# EAGLE design Prop_Fan (EAGLE 7.4.0)
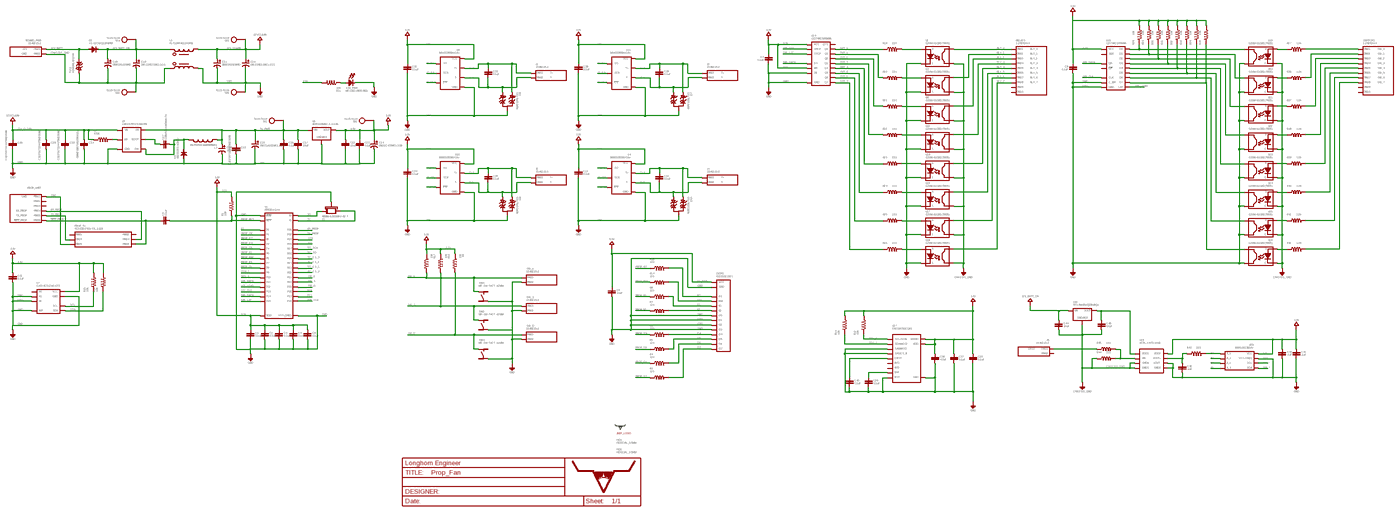
[diagram p0: schematic, sheet 1, overview]
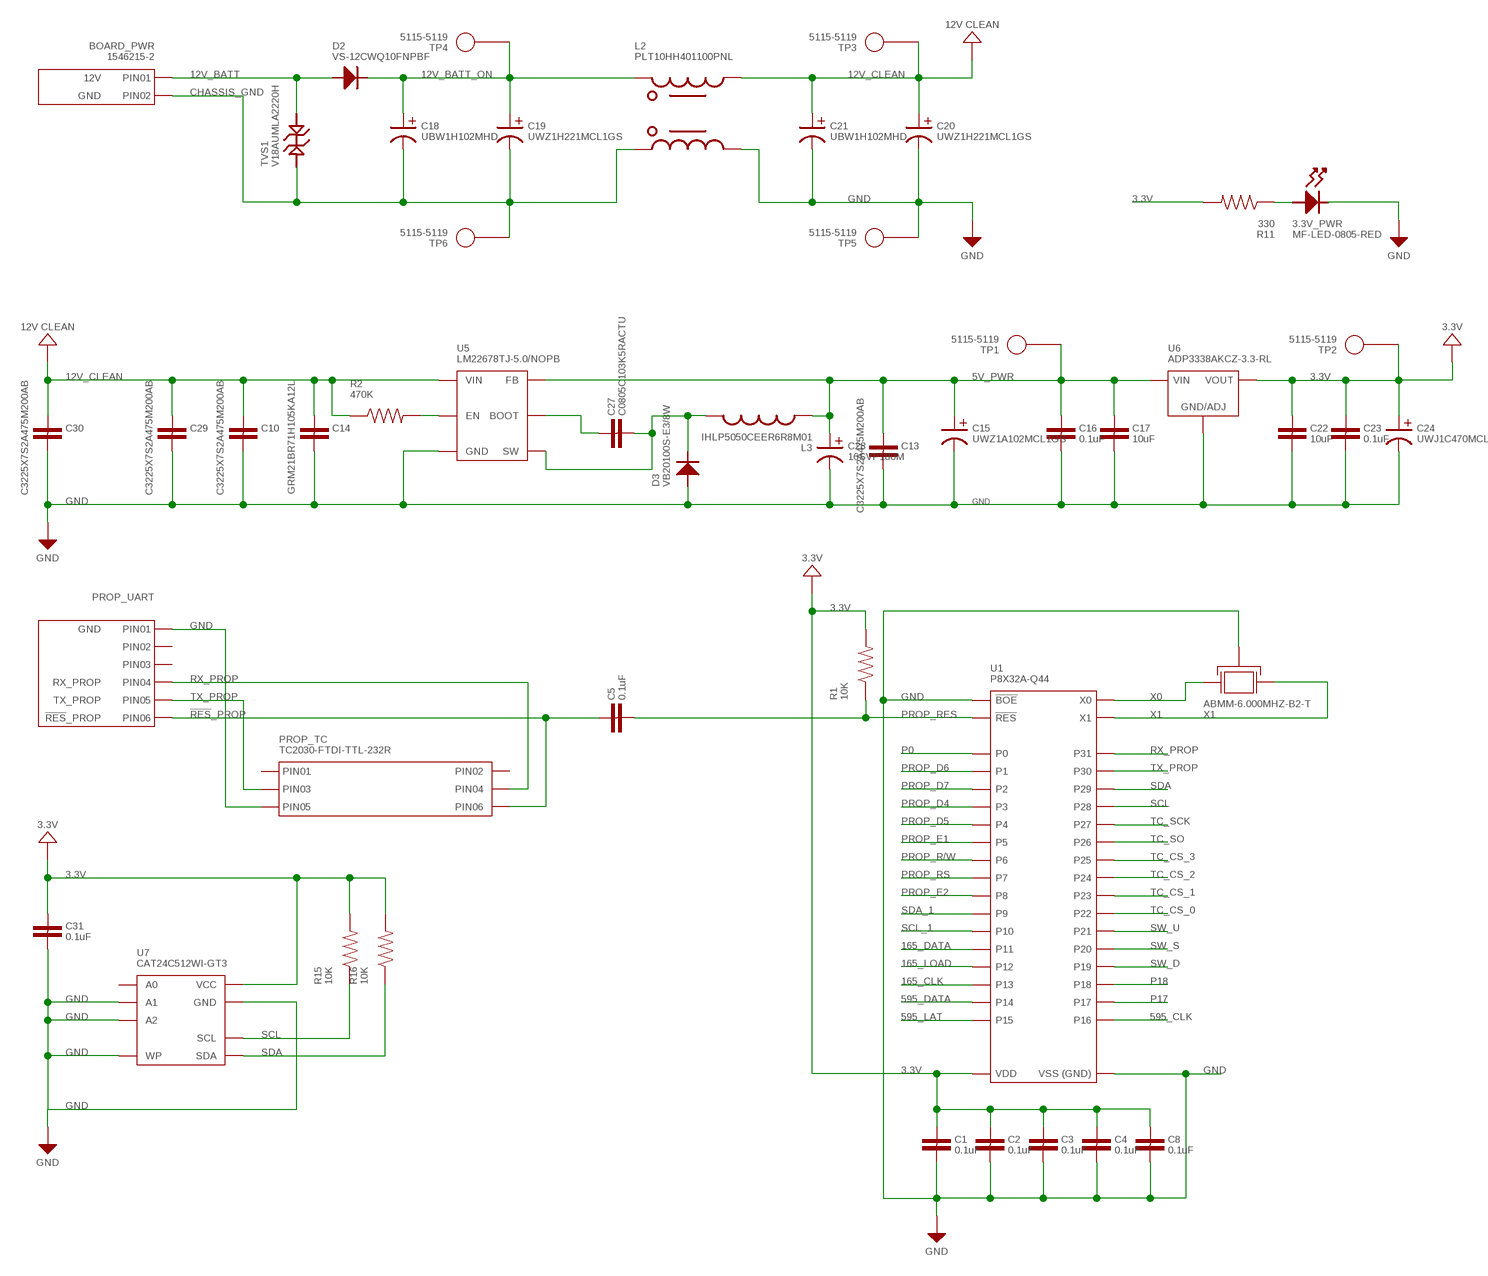
[diagram p1: schematic, sheet 1, part 1 of 4]
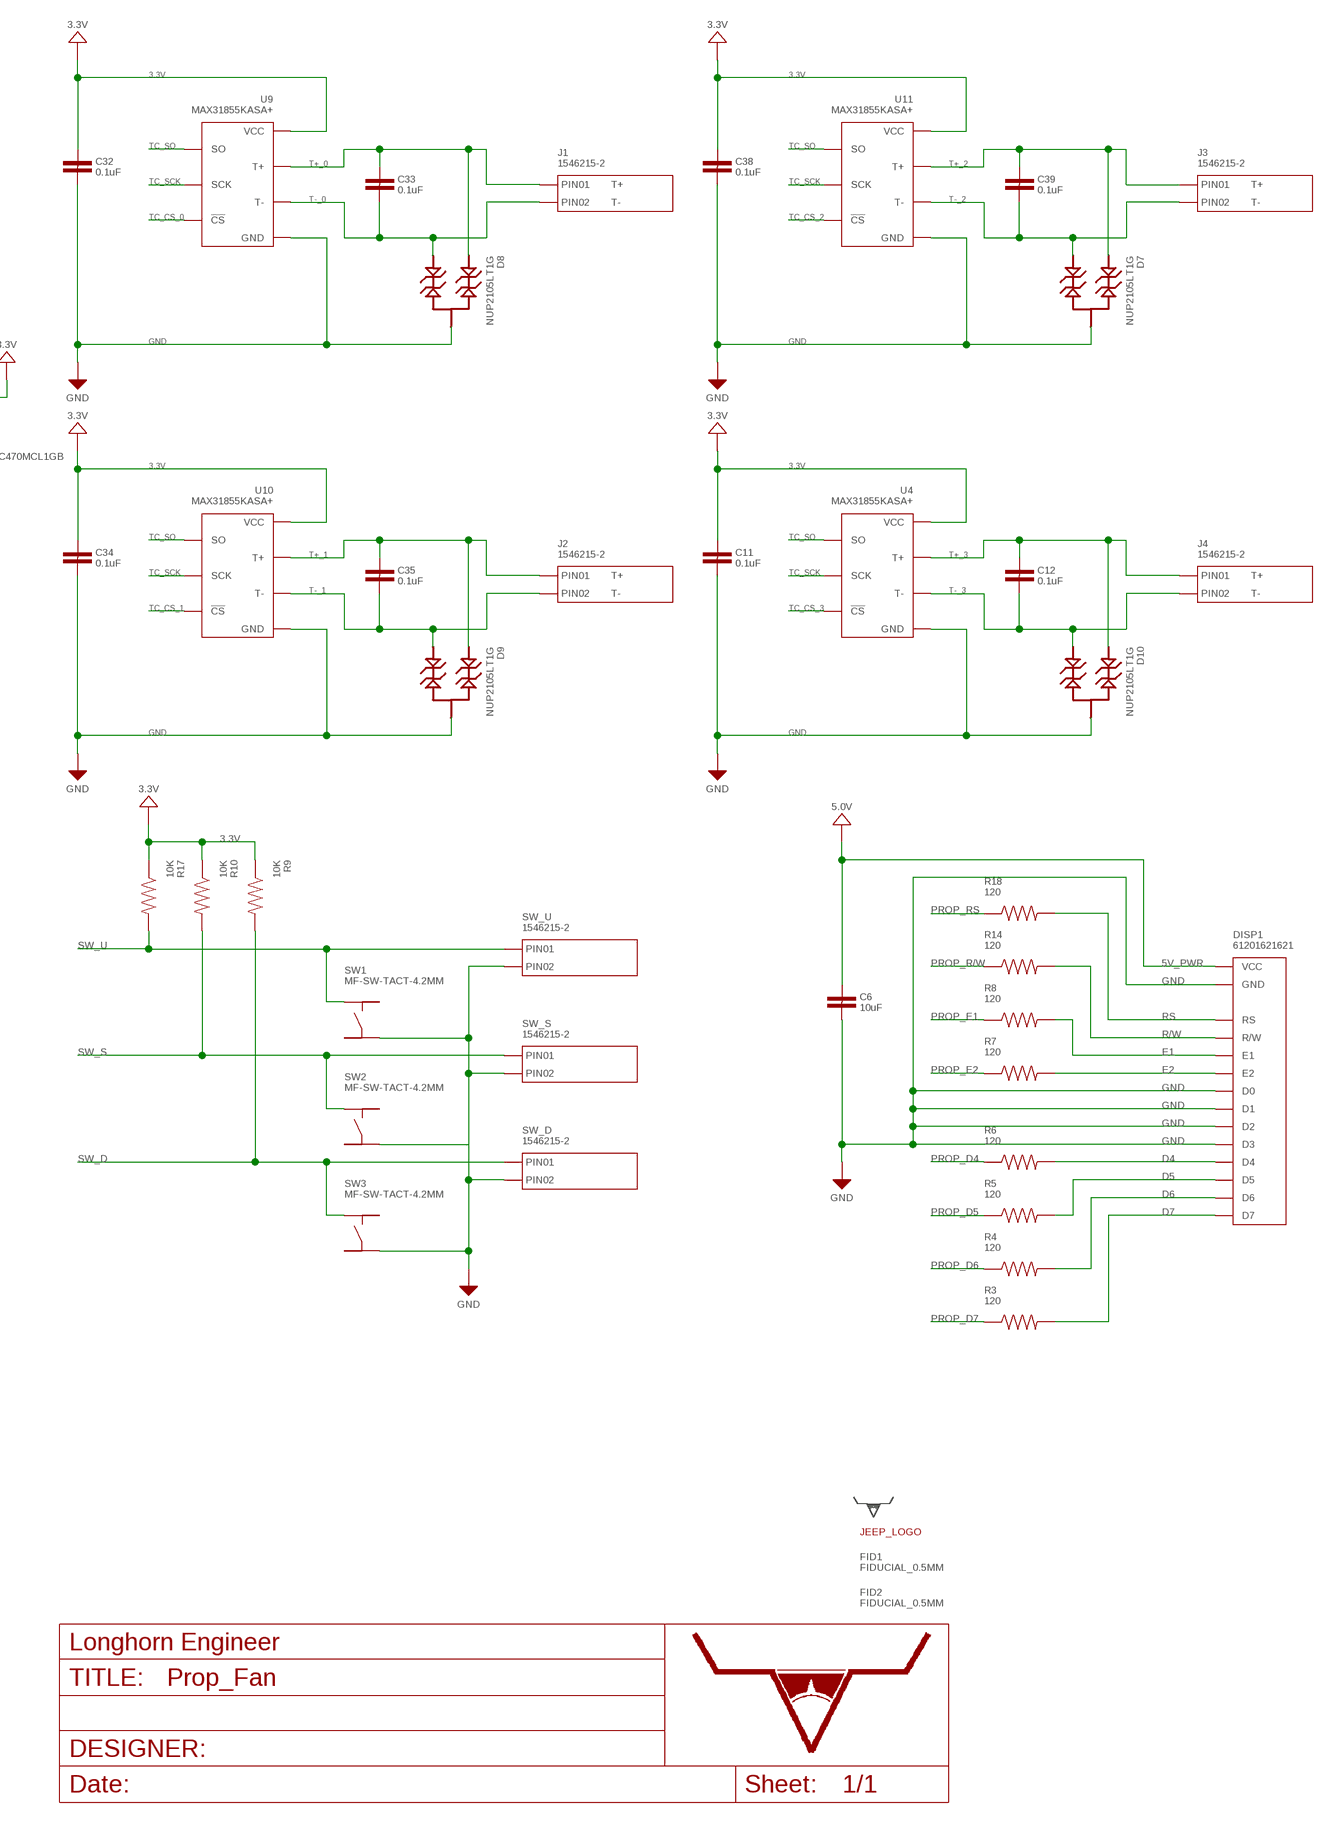
[diagram p2: schematic, sheet 1, part 2 of 4]
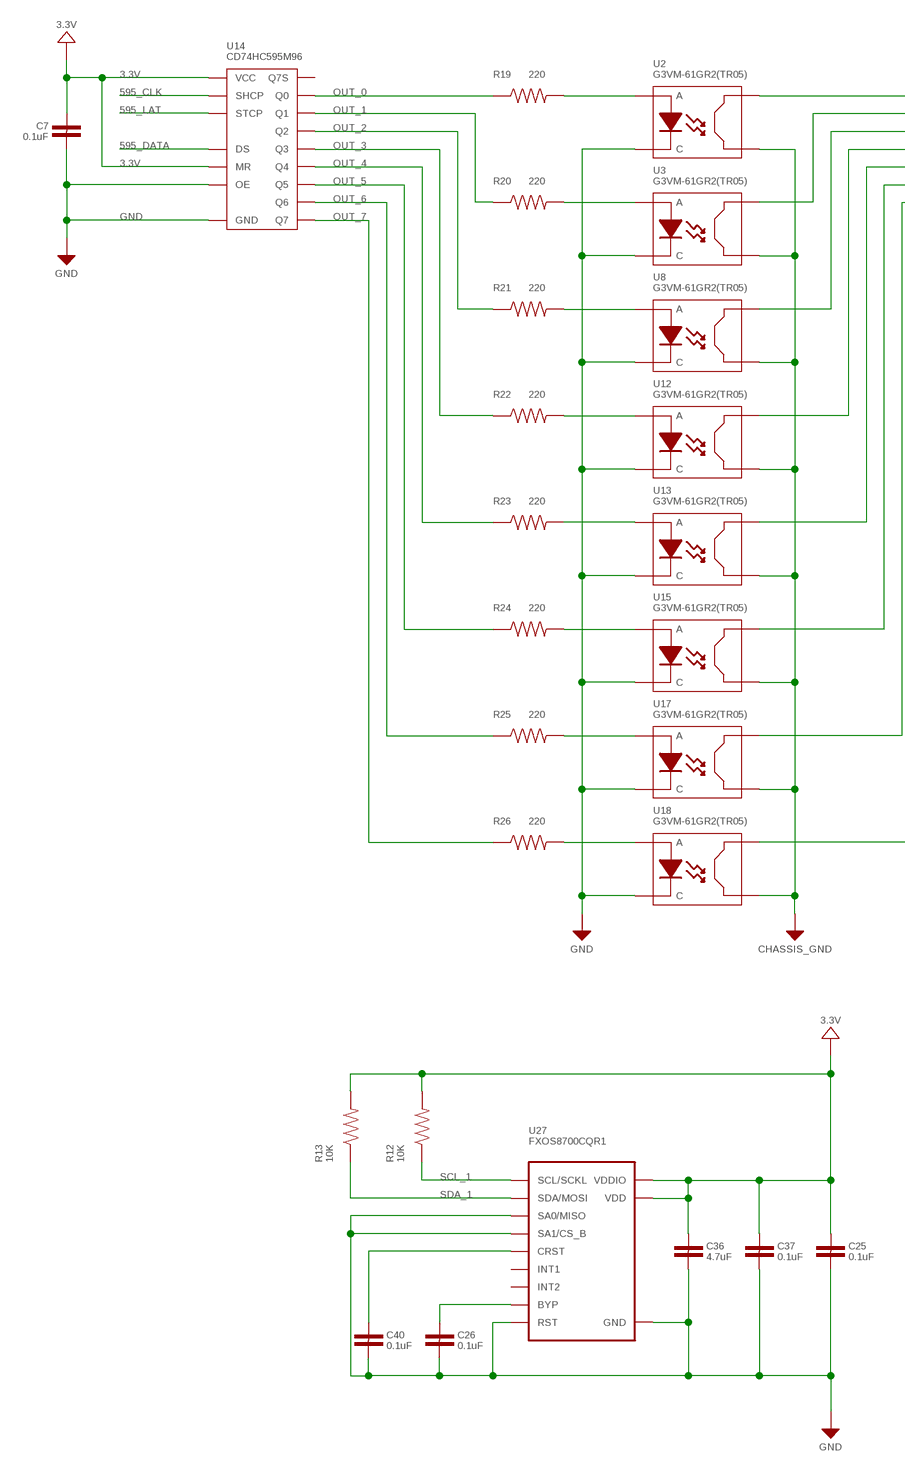
[diagram p3: schematic, sheet 1, part 3 of 4]
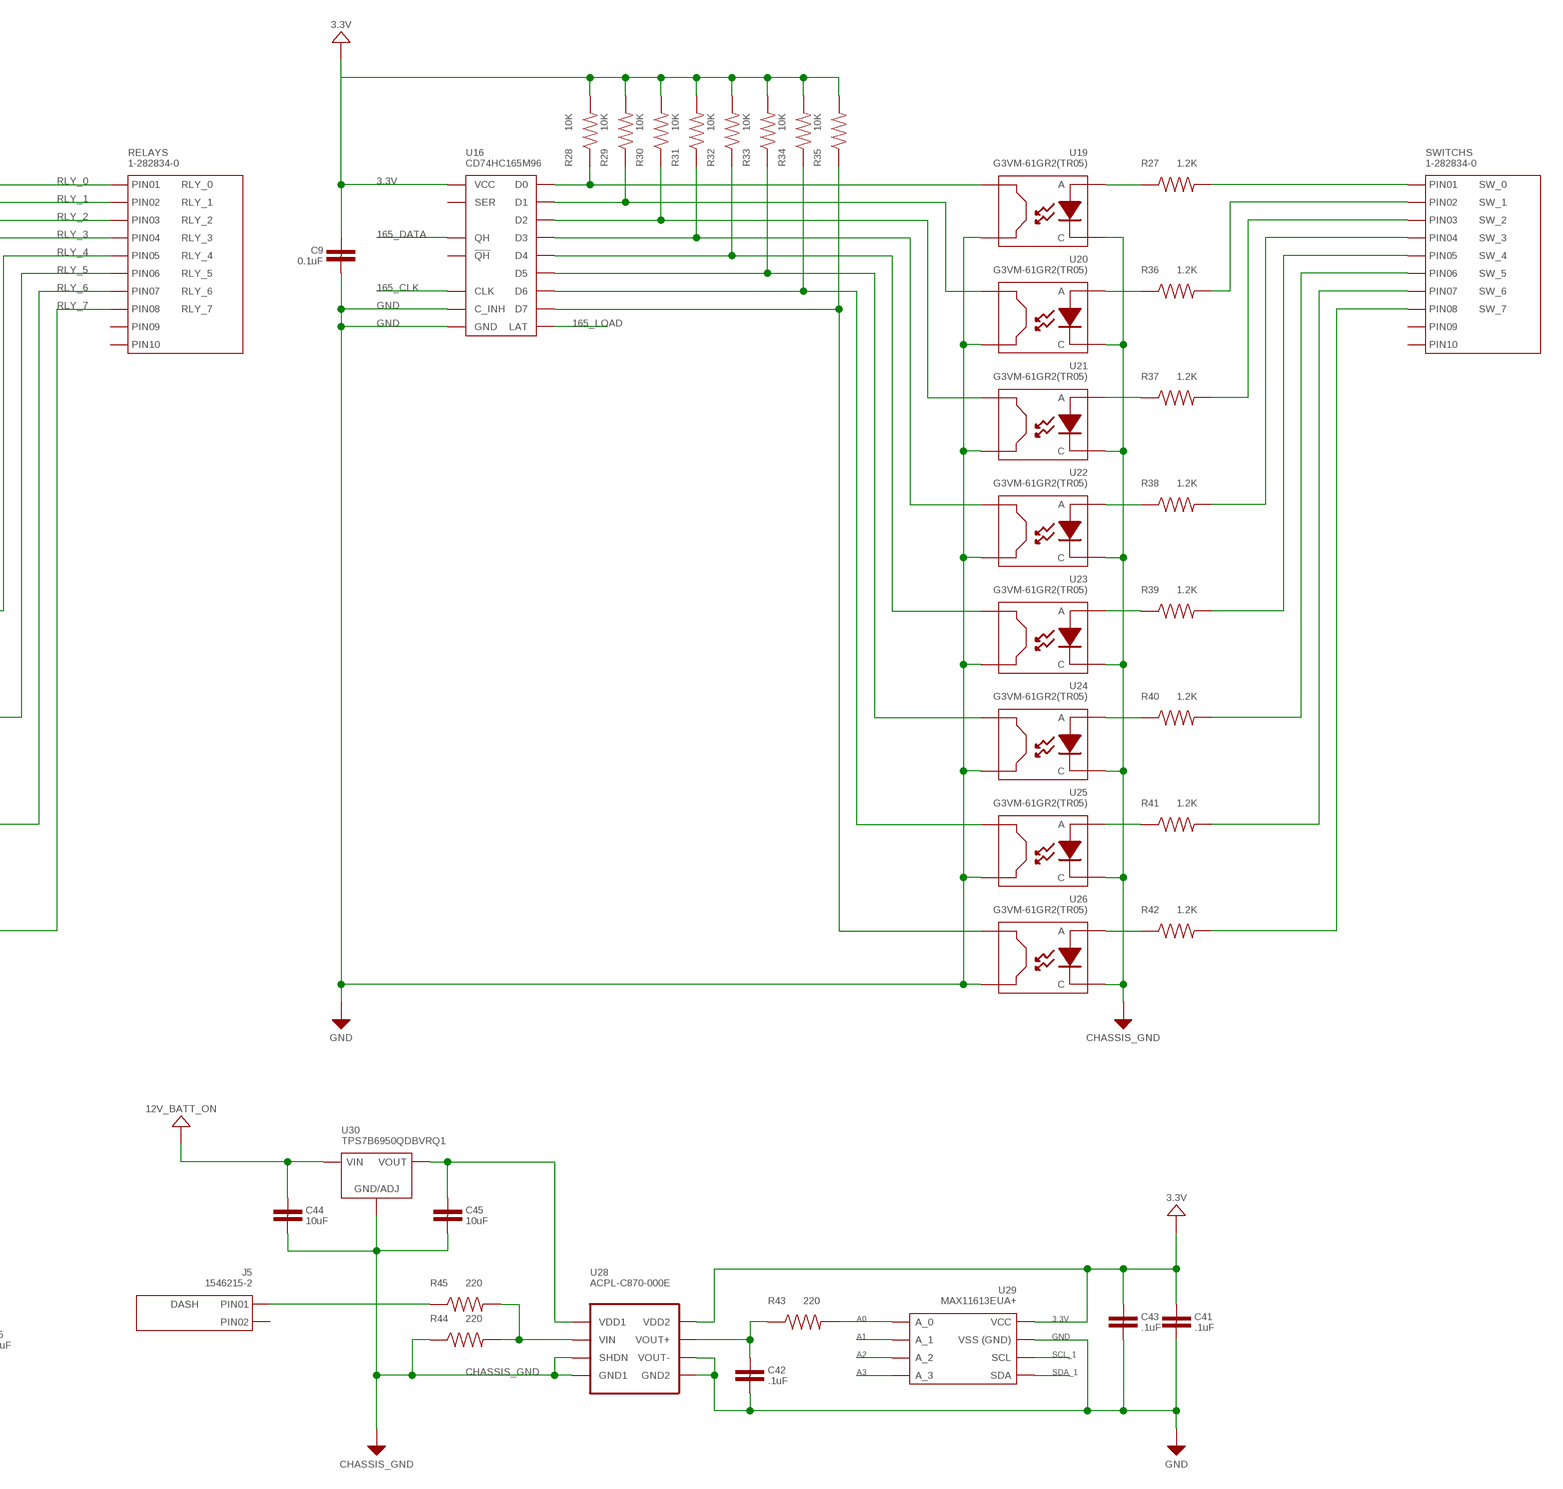
[diagram p4: schematic, sheet 1, part 4 of 4]

## Parts
3.3V_PWR  MF-LED-0805-RED  LED_SINGLE_0805  [LED_0805]
BOARD_PWR  1546215-2  CON_01X02_1546215-2  [1546215-2]
C1  0.1uF  CAPACITOR_NON_POLAR_0805  [0805]
C2  0.1uF  CAPACITOR_NON_POLAR_0805  [0805]
C3  0.1uF  CAPACITOR_NON_POLAR_0805  [0805]
C4  0.1uF  CAPACITOR_NON_POLAR_0805  [0805]
C5  0.1uF  CAPACITOR_NON_POLAR_0603  [0603]
C6  10uF  CAPACITOR_NON_POLAR_1210  [1210]
C7  0.1uF  CAPACITOR_NON_POLAR_0805  [0805]
C8  0.1uF  CAPACITOR_NON_POLAR_0805  [0805]
C9  0.1uF  CAPACITOR_NON_POLAR_0805  [0805]
C10  C3225X7S2A475M200AB  CAPACITOR_NON_POLAR_1210  [1210]
C11  0.1uF  CAPACITOR_NON_POLAR_0805  [0805]
C12  0.1uF  CAPACITOR_NON_POLAR_0805  [0805]
C13  C3225X7S2A475M200AB  CAPACITOR_NON_POLAR_1210  [1210]
C14  GRM21BR71H105KA12L  CAPACITOR_NON_POLAR_0805  [0805]
C15  UWZ1A102MCL1GS  CAPACITOR_POLARIZED_10MM_SMD  [10MM_CAP_SMD]
C16  0.1uF  CAPACITOR_NON_POLAR_0805  [0805]
C17  10uF  CAPACITOR_NON_POLAR_1210  [1210]
C18  UBW1H102MHD  CAPACITOR_POLARIZED_12.5MM_PTH  [12.5MM_CAP_PTH]
C19  UWZ1H221MCL1GS  CAPACITOR_POLARIZED_10MM_SMD  [10MM_CAP_SMD]
C20  UWZ1H221MCL1GS  CAPACITOR_POLARIZED_10MM_SMD  [10MM_CAP_SMD]
C21  UBW1H102MHD  CAPACITOR_POLARIZED_12.5MM_PTH  [12.5MM_CAP_PTH]
C22  10uF  CAPACITOR_NON_POLAR_1210  [1210]
C23  0.1uF  CAPACITOR_NON_POLAR_0805  [0805]
C24  UWJ1C470MCL1GB  CAPACITOR_POLARIZED_6.3MM_SMD  [6.3MM_CAP_SMD]
C25  0.1uF  CAPACITOR_NON_POLAR_0805  [0805]
C26  0.1uF  CAPACITOR_NON_POLAR_0805  [0805]
C27  C0805C103K5RACTU  CAPACITOR_NON_POLAR_0805  [0805]
C28  16SVP180M  CAPACITOR_POLARIZED_8MM_SMD  [8MM_CAP_SMD]
C29  C3225X7S2A475M200AB  CAPACITOR_NON_POLAR_1210  [1210]
C30  C3225X7S2A475M200AB  CAPACITOR_NON_POLAR_1210  [1210]
C31  0.1uF  CAPACITOR_NON_POLAR_0805  [0805]
C32  0.1uF  CAPACITOR_NON_POLAR_0805  [0805]
C33  0.1uF  CAPACITOR_NON_POLAR_0805  [0805]
C34  0.1uF  CAPACITOR_NON_POLAR_0805  [0805]
C35  0.1uF  CAPACITOR_NON_POLAR_0805  [0805]
C36  4.7uF  CAPACITOR_NON_POLAR_0805  [0805]
C37  0.1uF  CAPACITOR_NON_POLAR_0805  [0805]
C38  0.1uF  CAPACITOR_NON_POLAR_0805  [0805]
C39  0.1uF  CAPACITOR_NON_POLAR_0805  [0805]
C40  0.1uF  CAPACITOR_NON_POLAR_0805  [0805]
C41  .1uF  CAPACITOR_NON_POLAR_0603  [0603]
C42  .1uF  CAPACITOR_NON_POLAR_0603  [0603]
C43  .1uF  CAPACITOR_NON_POLAR_0603  [0603]
C44  10uF  CAPACITOR_NON_POLAR_1210  [1210]
C45  10uF  CAPACITOR_NON_POLAR_1210  [1210]
D2  VS-12CWQ10FNPBF  DIODE_D-PAK(TO-252AA)  [D-PAK(TO-252AA)]
D3  VB20100S-E3/8W  DIODE_D2PAK(TO-263AB)  [D2PAK(TO-263AB)]
D7  NUP2105LT1G  TVS_DIODE_DUALSOT-23  [SOT-23]
D8  NUP2105LT1G  TVS_DIODE_DUALSOT-23  [SOT-23]
D9  NUP2105LT1G  TVS_DIODE_DUALSOT-23  [SOT-23]
D10  NUP2105LT1G  TVS_DIODE_DUALSOT-23  [SOT-23]
DISP1  61201621621  CU40056-UW1J  [CU40045-UW1J]
FID1  FIDUCIAL_0.5MM  [FIDUCIAL_0.5MM]
FID2  FIDUCIAL_0.5MM  [FIDUCIAL_0.5MM]
J1  1546215-2  CON_01X02_1546215-2  [1546215-2]
J2  1546215-2  CON_01X02_1546215-2  [1546215-2]
J3  1546215-2  CON_01X02_1546215-2  [1546215-2]
J4  1546215-2  CON_01X02_1546215-2  [1546215-2]
J5  1546215-2  CON_01X02_1546215-2  [1546215-2]
L2  PLT10HH401100PNL  COMMON_MODE_INDUCTOR_PLT10H  [PLT10H]
L3  IHLP5050CEER6R8M01  INDUCTOR_IHLP-5050  [IHLP-5050]
PROP_TC  TC2030-FTDI-TTL-232R  CON_02X03_TC2030  [TC2030]
PROP_UART  CON_01X06_2.54MM_PIN_HEADER  [2.54MM_01X06_PIN_HEADER]
R1  10K  RESISTOR_0805  [0805]
R2  470K  RESISTOR_0603  [0603]
R3  120  RESISTOR_0603  [0603]
R4  120  RESISTOR_0603  [0603]
R5  120  RESISTOR_0603  [0603]
R6  120  RESISTOR_0603  [0603]
R7  120  RESISTOR_0603  [0603]
R8  120  RESISTOR_0603  [0603]
R9  10K  RESISTOR_0805  [0805]
R10  10K  RESISTOR_0805  [0805]
R11  330  RESISTOR_0603  [0603]
R12  10K  RESISTOR_0603  [0603]
R13  10K  RESISTOR_0603  [0603]
R14  120  RESISTOR_0603  [0603]
R15  10K  RESISTOR_0805  [0805]
R16  10K  RESISTOR_0805  [0805]
R17  10K  RESISTOR_0805  [0805]
R18  120  RESISTOR_0603  [0603]
R19  220  RESISTOR_0603  [R0603]
R20  220  RESISTOR_0603  [R0603]
R21  220  RESISTOR_0603  [R0603]
R22  220  RESISTOR_0603  [R0603]
R23  220  RESISTOR_0603  [R0603]
R24  220  RESISTOR_0603  [R0603]
R25  220  RESISTOR_0603  [R0603]
R26  220  RESISTOR_0603  [R0603]
R27  1.2K  RESISTOR_0603  [R0603]
R28  10K  RESISTOR_0603  [R0603]
R29  10K  RESISTOR_0603  [R0603]
R30  10K  RESISTOR_0603  [R0603]
R31  10K  RESISTOR_0603  [R0603]
R32  10K  RESISTOR_0603  [R0603]
R33  10K  RESISTOR_0603  [R0603]
R34  10K  RESISTOR_0603  [R0603]
R35  10K  RESISTOR_0603  [R0603]
R36  1.2K  RESISTOR_0603  [R0603]
R37  1.2K  RESISTOR_0603  [R0603]
R38  1.2K  RESISTOR_0603  [R0603]
R39  1.2K  RESISTOR_0603  [R0603]
R40  1.2K  RESISTOR_0603  [R0603]
R41  1.2K  RESISTOR_0603  [R0603]
R42  1.2K  RESISTOR_0603  [R0603]
R43  220  RESISTOR_0603  [R0603]
R44  220  RESISTOR_0603  [R0603]
R45  220  RESISTOR_0603  [R0603]
RELAYS  1-282834-0  CON_01X10_1-282834-0  [1-282834-0]
SW1  MF-SW-TACT-4.2MM  TACT_4.2MM  [TACT4.2MM]
SW2  MF-SW-TACT-4.2MM  TACT_4.2MM  [TACT4.2MM]
SW3  MF-SW-TACT-4.2MM  TACT_4.2MM  [TACT4.2MM]
SW_D  1546215-2  CON_01X02_1546215-2  [1546215-2]
SW_S  1546215-2  CON_01X02_1546215-2  [1546215-2]
SW_U  1546215-2  CON_01X02_1546215-2  [1546215-2]
SWITCHS  1-282834-0  CON_01X10_1-282834-0  [1-282834-0]
TP1  5115-5119  TEST_POINT_SINGLE_KEYSTONE_5115-5119  [KEYSTONE_5115-5119]
TP2  5115-5119  TEST_POINT_SINGLE_KEYSTONE_5115-5119  [KEYSTONE_5115-5119]
TP3  5115-5119  TEST_POINT_SINGLE_KEYSTONE_5115-5119  [KEYSTONE_5115-5119]
TP4  5115-5119  TEST_POINT_SINGLE_KEYSTONE_5115-5119  [KEYSTONE_5115-5119]
TP5  5115-5119  TEST_POINT_SINGLE_KEYSTONE_5115-5119  [KEYSTONE_5115-5119]
TP6  5115-5119  TEST_POINT_SINGLE_KEYSTONE_5115-5119  [KEYSTONE_5115-5119]
TVS1  V18AUMLA2220H  TVS_DIODE_2220  [2220]
U1  P8X32A-Q44  [LQFP44]
U2  G3VM-61GR2(TR05)  G3VM-61GR2  [G3VM-61GR2]
U3  G3VM-61GR2(TR05)  G3VM-61GR2  [G3VM-61GR2]
U4  MAX31855KASA+  MAX31855  [MAX31855_SO-8]
U5  LM22678TJ-5.0/NOPB  LM22678  [LM22678_TO-263-EP-7]
U6  ADP3338AKCZ-3.3-RL  LINEAR_VOTLAGE_REGULATORS_ADP3338  [ADP3338_SOT-223-3]
U7  CAT24C512WI-GT3  EEPROM_I2CSOIC-8_W  [SOIC-8_W]
U8  G3VM-61GR2(TR05)  G3VM-61GR2  [G3VM-61GR2]
U9  MAX31855KASA+  MAX31855  [MAX31855_SO-8]
U10  MAX31855KASA+  MAX31855  [MAX31855_SO-8]
U11  MAX31855KASA+  MAX31855  [MAX31855_SO-8]
U12  G3VM-61GR2(TR05)  G3VM-61GR2  [G3VM-61GR2]
U13  G3VM-61GR2(TR05)  G3VM-61GR2  [G3VM-61GR2]
U14  CD74HC595M96  [CD74HC595_SOIC-16]
U15  G3VM-61GR2(TR05)  G3VM-61GR2  [G3VM-61GR2]
U16  CD74HC165M96  [CD74HC165_SOIC-16]
U17  G3VM-61GR2(TR05)  G3VM-61GR2  [G3VM-61GR2]
U18  G3VM-61GR2(TR05)  G3VM-61GR2  [G3VM-61GR2]
U19  G3VM-61GR2(TR05)  G3VM-61GR2  [G3VM-61GR2]
U20  G3VM-61GR2(TR05)  G3VM-61GR2  [G3VM-61GR2]
U21  G3VM-61GR2(TR05)  G3VM-61GR2  [G3VM-61GR2]
U22  G3VM-61GR2(TR05)  G3VM-61GR2  [G3VM-61GR2]
U23  G3VM-61GR2(TR05)  G3VM-61GR2  [G3VM-61GR2]
U24  G3VM-61GR2(TR05)  G3VM-61GR2  [G3VM-61GR2]
U25  G3VM-61GR2(TR05)  G3VM-61GR2  [G3VM-61GR2]
U26  G3VM-61GR2(TR05)  G3VM-61GR2  [G3VM-61GR2]
U27  FXOS8700CQR1  [FXOS8700CQR1]
U28  ACPL-C870-000E  ACPL-C87X  [ACPL-C87_SSO-8]
U29  MAX11613EUA+  [MAX11613_UMAX-8]
U30  TPS7B6950QDBVRQ1  TPS7B69  [SOT-23-5]
U$1  LHE_FRAME  [LHE_FRAME]
U$35  JEEP_LOGO_SILK_MEDIUM  [JEEP_SILK_MEDIUM]
U$42  LHE_LOGOLHE_LOGO  [LHE_LOGO]
X1  ABMM-6.000MHZ-B2-T  XTL_7MMX5MM  [7MMX5MM]

## Nets
3.3V: C1.1 C2.1 C3.1 C4.1 C7.1 C8.1 C9.1 C11.1 C22.1 C23.1 C24.POS C25.1 C31.1 C32.1 C34.1 C36.1 C37.1 C38.1 C41.1 C43.1 R1.2 R9.1 R10.1 R11.2 R12.2 R13.2 R15.2 R16.2 R17.1 R28.P$2 R29.P$2 R30.P$2 R31.P$2 R32.P$2 R33.P$2 R34.P$2 R35.P$2 TP2.P$1 U1.8(VDD) U1.18(VDD) U1.30(VDD) U1.40(VDD) U4.4(VCC) U6.2(OUT) U6.PAD(OUT) U7.8(VCC) U9.4(VCC) U10.4(VCC) U11.4(VCC) U14.10(MR) U14.16(VCC) U16.16(VCC) U27.P$1(VDDIO) U27.P$14(VDD) U28.P$8(VDD2) U29.P$8(VCC)
5V_PWR: C6.1 C13.1 C15.POS C16.1 C17.1 C28.POS DISP1.P$13(VCC) L3.1 TP1.P$1 U5.P$6(FB) U6.3(IN) ; supply symbol labelled 5.0V
12V_BATT: BOARD_PWR.P$1(PIN1) D2.1(ANODE) D2.3(ANODE) TVS1.P$2
12V_BATT_ON: C18.POS C19.POS C44.1 D2.PAD-4(CATHODE) L2.1 TP4.P$1 U30.P$1(VIN)
12V_CLEAN: C10.1 C14.1 C20.POS C21.POS C29.1 C30.1 L2.2 R2.1 TP3.P$1 U5.P$2(VIN) ; supply symbol labelled 12V CLEAN
165_CLK: U1.14(P13) U16.2(CLK)
165_DATA: U1.12(P11) U16.9(QH)
165_LOAD: U1.13(P12) U16.1(LAT)
595_CLK: U1.19(P16) U14.11(SHCP)
595_DATA: U1.15(P14) U14.14(DS)
595_LAT: U1.16(P15) U14.12(STCP)
!RES!_PROP: C5.1 PROP_TC.P$6(PIN6) PROP_UART.6
A0: R43.P$2 U29.P$1(A_0)
A1: U29.P$2(A_1)
A2: U29.P$3(A_2)
A3: U29.P$4(A_3)
CHASSIS_GND: BOARD_PWR.P$2(PIN2) C18.NEG C19.NEG C44.2 C45.2 L2.4 R44.P$1 TP6.P$1 TVS1.P$1 U2.P$3 U3.P$3 U8.P$3 U12.P$3 U13.P$3 U15.P$3 U17.P$3 U18.P$3 U19.P$2(CATHODE) U20.P$2(CATHODE) U21.P$2(CATHODE) U22.P$2(CATHODE) U23.P$2(CATHODE) U24.P$2(CATHODE) U25.P$2(CATHODE) U26.P$2(CATHODE) U28.P$3(SHDN) U28.P$4(GND1) U30.P$3(GND/ADJ) U30.P$4(GND/ADJ)
D4: DISP1.P$3(D4) R6.2
D5: DISP1.P$4(D5) R5.2
D6: DISP1.P$1(D6) R4.2
D7: DISP1.P$2(D7) R3.2
E1: DISP1.P$10(E1) R8.2
E2: DISP1.P$16(E2) R7.2
EXT_5V: C45.1 U28.P$1(VDD1) U30.P$5(VOUT)
GND: 3.3V_PWR.CATHODE C1.2 C2.2 C3.2 C4.2 C6.2 C7.2 C8.2 C9.2 C10.2 C11.2 C13.2 C14.2 C15.NEG C16.2 C17.2 C20.NEG C21.NEG C22.2 C23.2 C24.NEG C25.2 C26.2 C28.NEG C29.2 C30.2 C31.2 C32.2 C34.2 C36.2 C37.2 C38.2 C40.2 C41.2 C42.2 C43.2 D3.A(ANODE) D7.3 D8.3 D9.3 D10.3 DISP1.P$5(D2) DISP1.P$6(D3) DISP1.P$7(D0) DISP1.P$8(D1) DISP1.P$14(GND) L2.3 PROP_TC.P$5(PIN5) PROP_UART.1 SW1.P$4 SW2.P$4 SW3.P$4 SW_D.P$2(PIN2) SW_S.P$2(PIN2) SW_U.P$2(PIN2) TP5.P$1 U1.5(VSS) U1.6(BOE') U1.17(VSS) U1.27(VSS) U1.39(VSS) U2.P$2(CATHODE) U3.P$2(CATHODE) U4.1(GND) U5.P$4(GND) U5.PAD(GND) U6.1(GND) U7.2(A1) U7.3(A2) U7.4(GND) U7.7(WP) U8.P$2(CATHODE) U9.1(GND) U10.1(GND) U11.1(GND) U12.P$2(CATHODE) U13.P$2(CATHODE) U14.8(GND) U14.13(OE) U15.P$2(CATHODE) U16.8(GND) U16.15(C_INH) U17.P$2(CATHODE) U18.P$2(CATHODE) U19.P$3 U20.P$3 U21.P$3 U22.P$3 U23.P$3 U24.P$3 U25.P$3 U26.P$3 U27.P$3(GND) U27.P$5(GND) U27.P$7(SA0/MISO) U27.P$10(SA1/CS_B) U27.P$12(GND) U27.P$13(GND) U27.P$16(RST) U28.P$5(GND2) U28.P$6(VOUT-) U29.P$7(GND) X1.P$2(GND) X1.P$4(GND)
IN_OPTO_1: R29.P$1 U16.12(D1) U20.P$4
IN_OPTO_2: R30.P$1 U16.13(D2) U21.P$4
IN_OPTO_3: R31.P$1 U16.14(D3) U22.P$4
IN_OPTO_4: R32.P$1 U16.3(D4) U23.P$4
IN_OPTO_5: R33.P$1 U16.4(D5) U24.P$4
IN_OPTO_6: R34.P$1 U16.5(D6) U25.P$4
IN_OPTO_7: R35.P$1 U16.6(D7) U26.P$4
N$1: R28.P$1 U16.11(D0) U19.P$4
N$2: C27.1 U5.P$3(BOOT)
N$3: R27.P$1 U19.P$1(ANODE)
N$4: R36.P$1 U20.P$1(ANODE)
N$5: C27.2 D3.C(CATHODE) L3.2 U5.P$1(SW)
N$6: R37.P$1 U21.P$1(ANODE)
N$7: C26.1 U27.P$2(BYP)
N$8: C40.1 U27.P$8(CRST)
N$9: 3.3V_PWR.ANODE R11.1
N$10: R38.P$1 U22.P$1(ANODE)
N$11: R19.P$2 U2.P$1(ANODE)
N$12: R20.P$2 U3.P$1(ANODE)
N$13: R21.P$2 U8.P$1(ANODE)
N$14: R22.P$2 U12.P$1(ANODE)
N$15: R23.P$2 U13.P$1(ANODE)
N$16: R24.P$2 U15.P$1(ANODE)
N$17: R25.P$2 U17.P$1(ANODE)
N$18: R26.P$2 U18.P$1(ANODE)
N$19: R39.P$1 U23.P$1(ANODE)
N$20: R40.P$1 U24.P$1(ANODE)
N$21: R41.P$1 U25.P$1(ANODE)
N$22: R42.P$1 U26.P$1(ANODE)
N$23: R27.P$2 SWITCHS.P$1
N$24: R36.P$2 SWITCHS.P$2
N$25: R37.P$2 SWITCHS.P$3
N$26: R38.P$2 SWITCHS.P$4
N$27: R39.P$2 SWITCHS.P$5
N$28: R40.P$2 SWITCHS.P$6
N$29: R41.P$2 SWITCHS.P$7
N$30: R42.P$2 SWITCHS.P$8
N$31: R2.2 U5.P$7(EN)
N$32: C42.1 R43.P$1 U28.P$7(VOUT+)
N$33: R44.P$2 R45.P$2 U28.P$2(VIN)
N$36: J5.P$1(PIN1) R45.P$1
OUT_0: R19.P$1 U14.15(Q0)
OUT_1: R20.P$1 U14.1(Q1)
OUT_2: R21.P$1 U14.2(Q2)
OUT_3: R22.P$1 U14.3(Q3)
OUT_4: R23.P$1 U14.4(Q4)
OUT_5: R24.P$1 U14.5(Q5)
OUT_6: R25.P$1 U14.6(Q6)
OUT_7: R26.P$1 U14.7(Q7)
P0: U1.41(P0)
P17: U1.20(P17)
P18: U1.21(P18)
PROP_D4: R6.1 U1.44(P3)
PROP_D5: R5.1 U1.1(P4)
PROP_D6: R4.1 U1.42(P1)
PROP_D7: R3.1 U1.43(P2)
PROP_E1: R8.1 U1.2(P5)
PROP_E2: R7.1 U1.9(P8)
PROP_R/W: R14.1 U1.3(P6)
PROP_RES: C5.2 R1.1 U1.7(RES')
PROP_RS: R18.1 U1.4(P7)
R/W: DISP1.P$9(R/W) R14.2
RLY_0: RELAYS.P$1 U2.P$4
RLY_1: RELAYS.P$2 U3.P$4
RLY_2: RELAYS.P$3 U8.P$4
RLY_3: RELAYS.P$4 U12.P$4
RLY_4: RELAYS.P$5 U13.P$4
RLY_5: RELAYS.P$6 U15.P$4
RLY_6: RELAYS.P$7 U17.P$4
RLY_7: RELAYS.P$8 U18.P$4
RS: DISP1.P$12(RS) R18.2
RX_PROP: PROP_TC.P$4(PIN4) PROP_UART.4 U1.38(P31)
SCL: R15.1 U1.35(P28) U7.6(SCL)
SCL_1: R12.1 U1.11(P10) U27.P$4(SCL/SCKL) U29.P$5(SCL)
SDA: R16.1 U1.36(P29) U7.5(SDA)
SDA_1: R13.1 U1.10(P9) U27.P$6(SDA/MOSI) U29.P$6(SDA)
SW_D: R9.2 SW3.P$1 SW_D.P$1(PIN1) U1.22(P19)
SW_S: R10.2 SW2.P$1 SW_S.P$1(PIN1) U1.23(P20)
SW_U: R17.2 SW1.P$1 SW_U.P$1(PIN1) U1.24(P21)
T+_0: C33.1 D8.1 J1.P$1(PIN1) U9.3(T+)
T+_1: C35.1 D9.1 J2.P$1(PIN1) U10.3(T+)
T+_2: C39.1 D7.1 J3.P$1(PIN1) U11.3(T+)
T+_3: C12.1 D10.1 J4.P$1(PIN1) U4.3(T+)
T-_0: C33.2 D8.2 J1.P$2(PIN2) U9.2(T-)
T-_1: C35.2 D9.2 J2.P$2(PIN2) U10.2(T-)
T-_2: C39.2 D7.2 J3.P$2(PIN2) U11.2(T-)
T-_3: C12.2 D10.2 J4.P$2(PIN2) U4.2(T-)
TC_CS_0: U1.25(P22) U9.6(!CS)
TC_CS_1: U1.26(P23) U10.6(!CS)
TC_CS_2: U1.31(P24) U11.6(!CS)
TC_CS_3: U1.32(P25) U4.6(!CS)
TC_SCK: U1.34(P27) U4.5(SCK) U9.5(SCK) U10.5(SCK) U11.5(SCK)
TC_SO: U1.33(P26) U4.7(SO) U9.7(SO) U10.7(SO) U11.7(SO)
TX_PROP: PROP_TC.P$3(PIN3) PROP_UART.5 U1.37(P30)
X0: U1.29(X0) X1.P$1(X0)
X1: U1.28(X1) X1.P$3(X1)
Unconnected: J5.P$2(PIN2) PROP_TC.P$1(PIN1) PROP_TC.P$2(PIN2) PROP_UART.2 PROP_UART.3 RELAYS.P$9 RELAYS.P$10 SW1.P$2 SW1.P$3 SW2.P$2 SW2.P$3 SW3.P$2 SW3.P$3 SWITCHS.P$9 SWITCHS.P$10 U7.1(A0) U14.9(Q7S) U16.7(QH') U16.10(SER) U27.P$9(INT2) U27.P$11(INT1)

## Library data of the parts
3.3V_PWR = PP_LED:LED_SINGLE
BOARD_PWR = PP_Connectors:CON_01X02; LABEL01: 12V; LABEL02: GND
C1-C14 C16 C17 C22 C23 C25-C27 C29-C45 = PP_Passives:CAPACITOR_NON_POLAR: Capacitor Non Polarized
C15 C18-C21 C24 C28 = PP_Passives:CAPACITOR_POLARIZED: Polarized capacitors
D2 D3 = PP_Passives:DIODE: Diode - Single
D7-D10 = PP_Passives:TVS_DIODE_DUAL
DISP1 = PP_Displays:CU40056-UW1J
FID1 FID2 = MF_Aesthetics:FIDUCIAL: Library: MF_Aesthetics Description: Fiducial marking for PCB alignment inside PNP and other machines.
J1-J4 = PP_Connectors:CON_01X02; LABEL01: T+; LABEL02: T-
J5 = PP_Connectors:CON_01X02; LABEL01: DASH
L2 = PP_Passives:COMMON_MODE_INDUCTOR
L3 = PP_Passives:INDUCTOR: Inductors
PROP_TC = PP_Connectors:CON_02X03
PROP_UART = PP_Connectors:CON_01X06: 6 pin connectors; LABEL01: GND; LABEL04: RX_PROP; LABEL05: TX_PROP; LABEL06: !RES!_PROP
R1-R18 = PP_Passives:RESISTOR: Resistors
R19-R45 = MF_Passives:RESISTOR: Library: MF_Passives Description: Device for Resistors. Manufacture part number (MFG#), Voltage, Tolerance, and Wattage Rating can be added via Attributes.; MFG#: N/A; TOLERANCE: N/A; VOLTAGE: N/A; WATTAGE: N/A
RELAYS = PP_Connectors:CON_01X10; LABEL01: RLY_0; LABEL02: RLY_1; LABEL03: RLY_2; LABEL04: RLY_3; LABEL05: RLY_4; LABEL06: RLY_5; LABEL07: RLY_6; LABEL08: RLY_7
SW1-SW3 = MF_Switches:TACT: Library: MF_Switches Description: Device for Tact Switches. Manufacture part number (MFG#) can be added via Attributes.
SW_D SW_S SW_U = PP_Connectors:CON_01X02
SWITCHS = PP_Connectors:CON_01X10; LABEL01: SW_0; LABEL02: SW_1; LABEL03: SW_2; LABEL04: SW_3; LABEL05: SW_4; LABEL06: SW_5; LABEL07: SW_6; LABEL08: SW_7
TP1-TP6 = PP_Connectors:TEST_POINT_SINGLE
TVS1 = PP_Passives:TVS_DIODE
U1 = MF_IC_Digital:P8X32A: Manufacturer Part #: P8X32A Manufacturer: Parallax Description: 32-bit Microcontrollers - MCU LQFP pkg Propeller Chip
U2 U3 U8 U12 U13 U15 U17-U26 = PP_DigitalIC:G3VM-61GR2
U4 U9-U11 = PP_Sensors:MAX31855: Manufacturer Part #: MAX31855 Manufacturer: Maxim Integrated Description: Sensor Interface Thermocouple To Digital Converter
U5 = PP_PowerIC:LM22678: Manufacturer Part #: LM22678 Manufacturer: Texas Instruments Description: Voltage Regulators - Switching Regulators 5A STEP-DOWN VLTG REG
U6 = PP_PowerIC:LINEAR_VOTLAGE_REGULATORS
U7 = PP_DigitalIC:EEPROM_I2C
U14 = PP_DigitalIC:CD74HC595: Manufacturer Part #: CD74HC595 Manufacturer: Texas Instruments Description: Counter Shift Registers 8-Bit Shift Register
U16 = PP_DigitalIC:CD74HC165: Manufacturer Part #: CD74HC165 Manufacturer: Texas Instruments Description: Counter Shift Registers High Speed CMOS 8-Bit Shift Register
U27 = PP_Sensors:FXOS8700CQR1
U28 = PP_AnalogIC:ACPL-C87X
U29 = PP_AnalogIC:MAX11613: Manufacturer Part #: MAX11613 Manufacturer: Maxim Integrated Description: Analog to Digital Converters - ADC 12-Bit 4Ch 94.4sps 3.6V Precision ADC
U30 = MF_IC_Power:TPS7B69: Manufacturer Part #: TPS7B69 Manufacturer: Texas Instruments Description: LDO Voltage Regulators
U$1 = PP_Aesthetics:LHE_FRAME; DNAME: Parker Dillmann; REVNUM: REV: 1
U$35 = PP_Aesthetics:JEEP_LOGO
U$42 = PP_Aesthetics:LHE_LOGO
X1 = MF_Frequency_Control:XTL: Library: MF_Frequency_Control Description: Device for Cyrstal Oscillators. Manufacture part number (MFG#) can be added via Attributes.

## Board
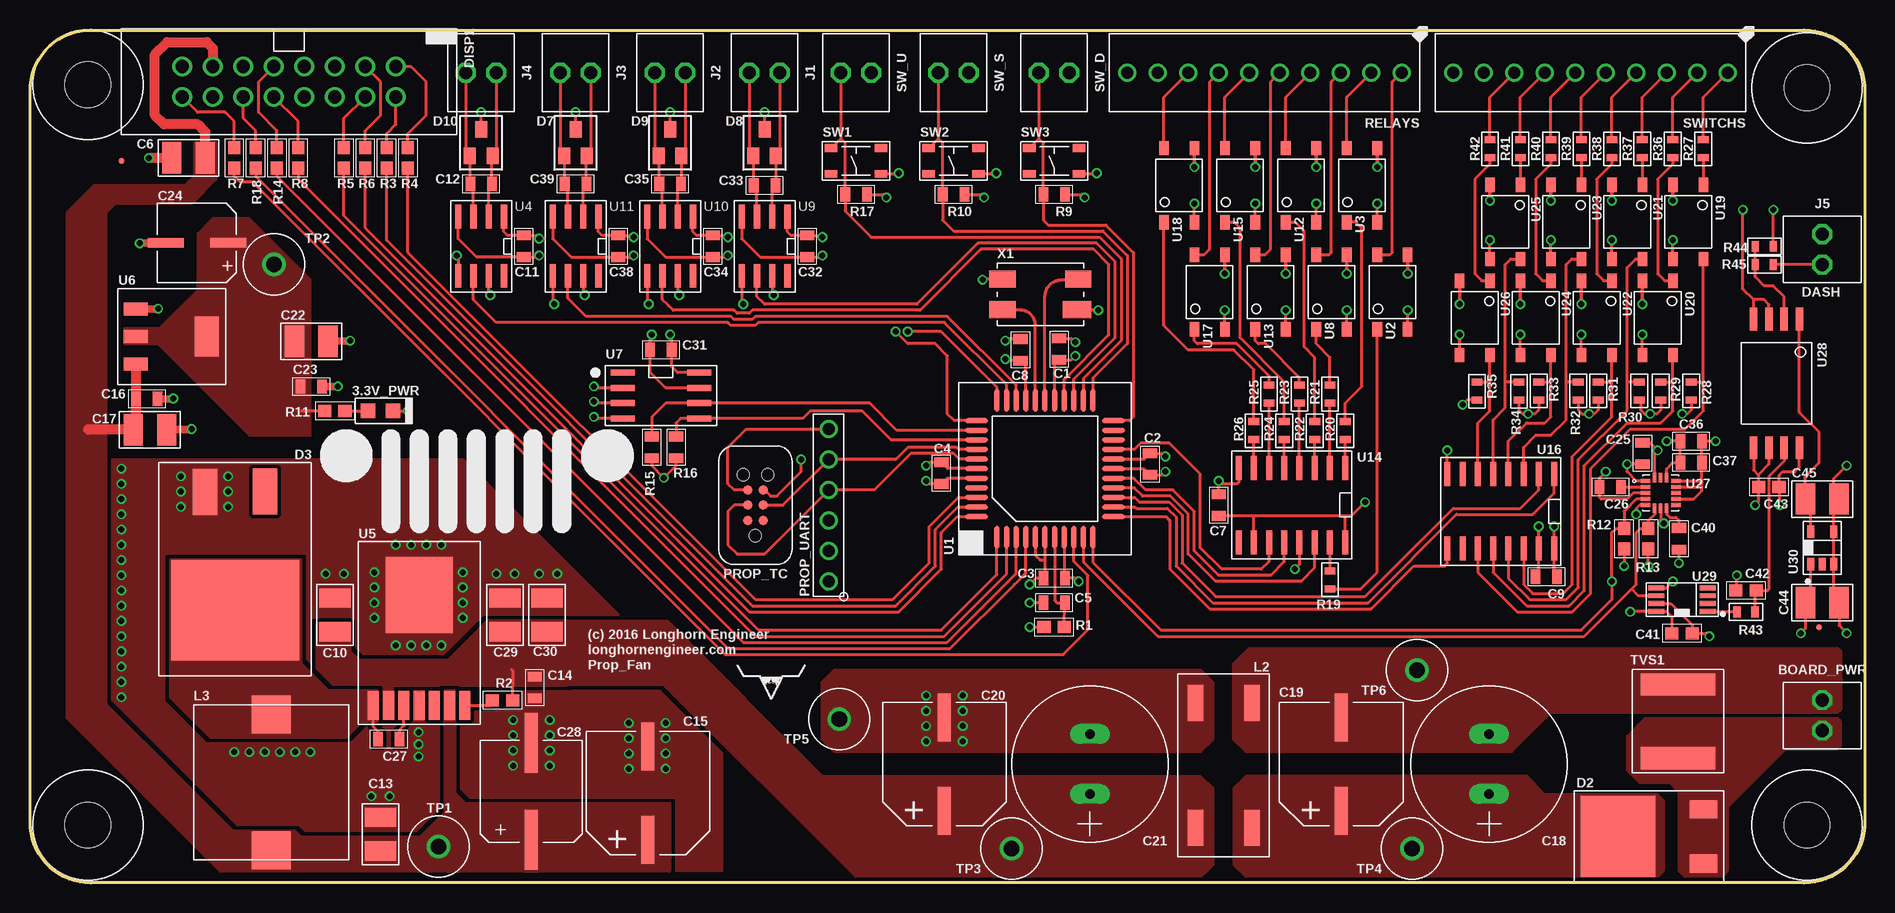
[diagram p5: board, top side]
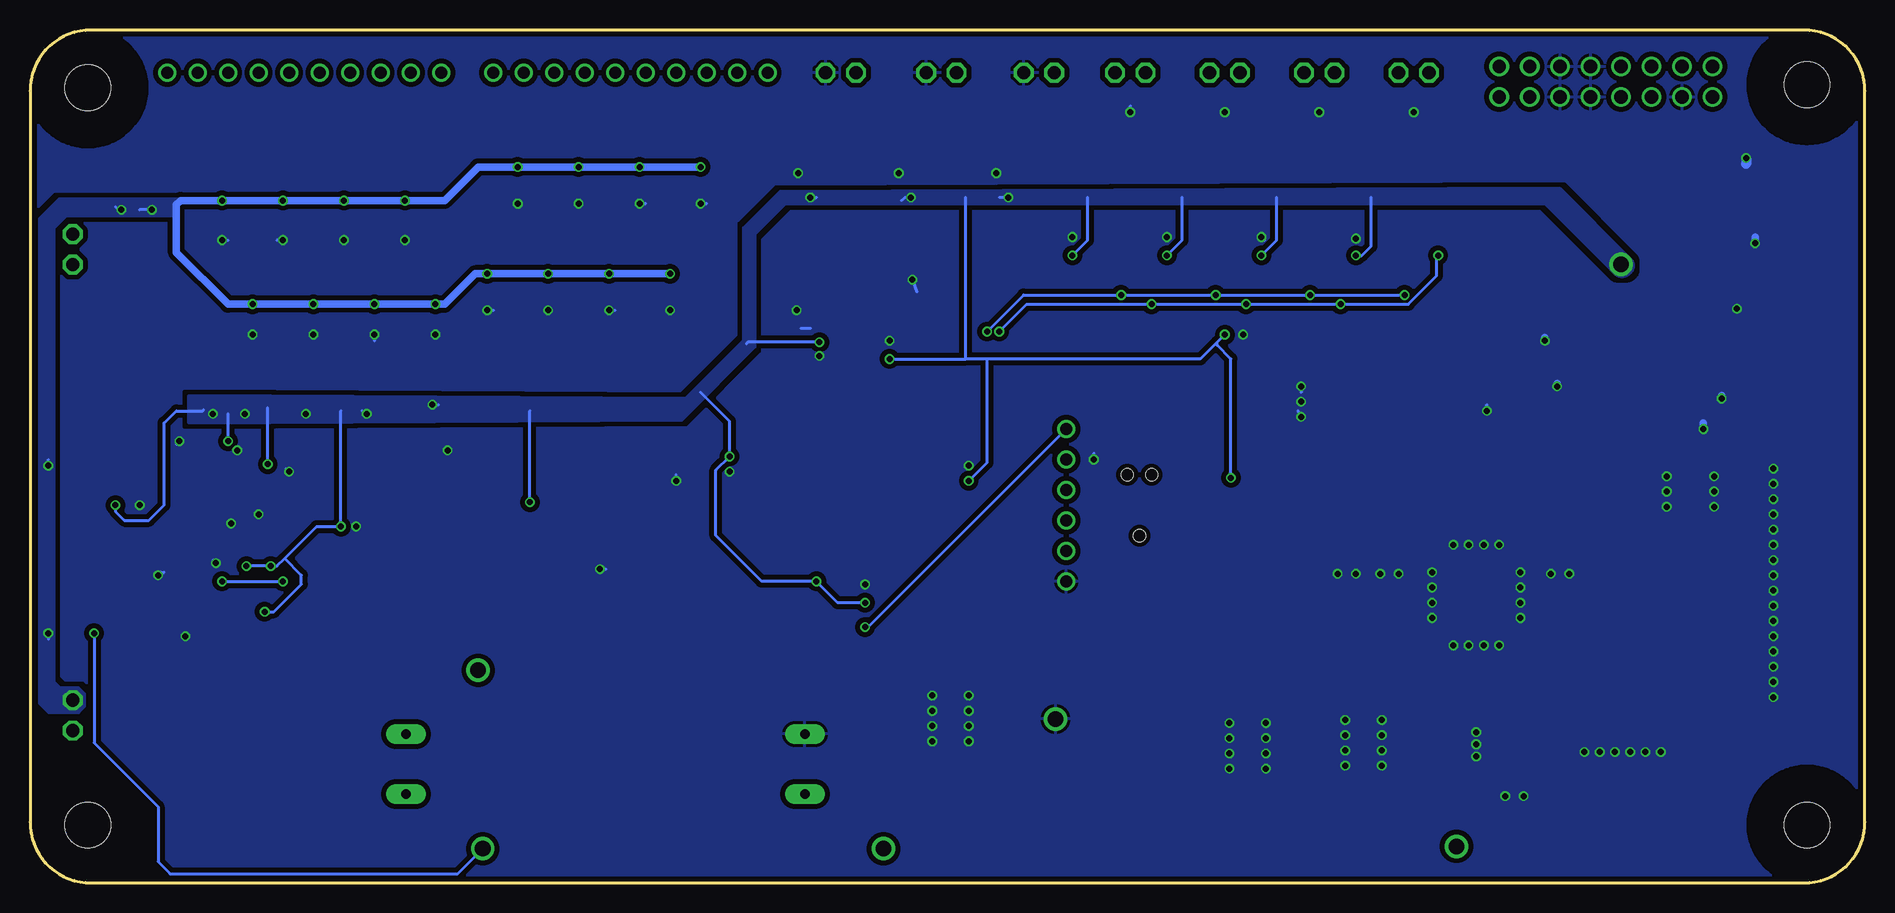
[diagram p6: board, bottom side, seen from below]

Size 152.91 x 71.12 mm. Coordinates in mm from the lower left corner, seen from the top.
Outline: 0,5.08 0,66.04 arc-90 5.08,71.12 147.83,71.12 arc-90 152.91,66.04 152.91,5.08 arc-90 147.83,0 5.08,0 arc-90 0,5.08
Copper layers (1*16): Top 0.035mm / dielectric 1.5mm / Bottom 0.035mm
Design rules "MF_Standard_2_Layer": minimum track width 6mil, minimum drill 12mil, track to track 6mil, track to pad 6mil, pad to pad 6mil, via to via 6mil, smd to smd 0mil, copper to edge 10mil, drill to drill 10mil, minimum pad ring 6mil, minimum via ring 6mil, stop-mask expansion 2mil, vias tented up to drill 25mil, thermal gap 10mil

### Footprints (pad centres in the part's own frame; a part is rotated, then mirrored left to right if it is on the bottom)
LED_0805 = smd 1.2 x 1.2: ANODE 1.05,0; CATHODE -1.05,0
1546215-2 = drill 1.1 octagon: P$1 -1.27,0; P$2 1.27,0
0805 = smd 0.8 x 1.2: 1 -0.9,0; 2 0.9,0
0603 = smd 1.1 x 1: 1 -0.85,0; 2 0.85,0
1210 = smd 1.6 x 2.6: 1 -1.4,0; 2 1.4,0
10MM_CAP_SMD = smd 1.1 x 4: NEG 0,-3.88; POS 0,3.88
12.5MM_CAP_PTH = drill 0.8 pad 1.676 long: NEG 0,-2.5; POS 0,2.5
6.3MM_CAP_SMD = smd 0.8 x 3: NEG 0,-2.6; POS 0,2.6
8MM_CAP_SMD = smd 1.1 x 5: NEG 0,-4.05; POS 0,4.05
D-PAK(TO-252AA) = smd 1.524 x 2.286: 1 -2.261,-10.249; 3 2.261,-10.249 | smd 6.731 x 6.223: PAD-4 0,-3.111
D2PAK(TO-263AB) = smd 2.032 x 3.81: A 2.5,-5.169; NOP -2.5,-5.205 | smd 10.66 x 8.38: C 0,4.7
SOT-23 = smd 1 x 1.4: 1 -0.95,-1.1; 2 0.95,-1.1; 3 0,1.1
CU40045-UW1J = drill 1.1: P$1 -1.27,8.89; P$2 1.27,8.89; P$3 -1.27,6.35; P$4 1.27,6.35; P$5 -1.27,3.81; P$6 1.27,3.81; P$7 -1.27,1.27; P$8 1.27,1.27; P$9 -1.27,-1.27; P$10 1.27,-1.27; P$11 -1.27,-3.81; P$12 1.27,-3.81; P$13 -1.27,-6.35; P$14 1.27,-6.35; P$15 -1.27,-8.89; P$16 1.27,-8.89
FIDUCIAL_0.5MM = smd 0.5 x 0.5: FID 0,0
PLT10H = smd 1.3 x 3: 1 -2.35,5.2; 2 2.35,5.2; 3 2.35,-5.2; 4 -2.35,-5.2
IHLP-5050 = smd 3.175 x 3.251: 1 -5.664,0; 2 5.664,0
TC2030 = smd 0.787 x 0.787: P$1 -1.27,-0.635; P$2 -1.27,0.635; P$3 0,-0.635; P$4 0,0.635; P$5 1.27,-0.635; P$6 1.27,0.635 | hole 0.991: 2.54,1.016; 2.54,-1.016; -2.54,0
2.54MM_01X06_PIN_HEADER = drill 1: 1 -6.35,0; 2 -3.81,0; 3 -1.27,0; 4 1.27,0; 5 3.81,0; 6 6.35,0
R0603 = smd 0.6 x 0.9: P$1 -0.75,0; P$2 0.75,0
1-282834-0 = drill 1: P$1 -11.43,0; P$2 -8.89,0; P$3 -6.35,0; P$4 -3.81,0; P$5 -1.27,0; P$6 1.27,0; P$7 3.81,0; P$8 6.35,0; P$9 8.89,0; P$10 11.43,0
TACT4.2MM = smd 1.05 x 0.65: P$1 -2.075,1.075; P$2 2.075,1.075; P$3 -2.075,-1.075; P$4 2.075,-1.075
KEYSTONE_5115-5119 = drill 1.3: P$1 0,0
2220 = smd 1.85 x 6.2: P$1 -3.075,0; P$2 3.075,0
LQFP44 = smd 1.9 x 0.4: 1 -5.7,4; 2 -5.7,3.2; 3 -5.7,2.4; 4 -5.7,1.6; 5 -5.7,0.8; 6 -5.7,0; 7 -5.7,-0.8; 8 -5.7,-1.6; 9 -5.7,-2.4; 10 -5.7,-3.2; 11 -5.7,-4; 23 5.7,-4; 24 5.7,-3.2; 25 5.7,-2.4; 26 5.7,-1.6; 27 5.7,-0.8; 28 5.7,0; 29 5.7,0.8; 30 5.7,1.6; 31 5.7,2.4; 32 5.7,3.2; 33 5.7,4 | smd 0.4 x 1.9: 12 -4,-5.7; 13 -3.2,-5.7; 14 -2.4,-5.7; 15 -1.6,-5.7; 16 -0.8,-5.7; 17 0,-5.7; 18 0.8,-5.7; 19 1.6,-5.7; 20 2.4,-5.7; 21 3.2,-5.7; 22 4,-5.7; 34 4,5.7; 35 3.2,5.7; 36 2.4,5.7; 37 1.6,5.7; 38 0.8,5.7; 39 0,5.7; 40 -0.8,5.7; 41 -1.6,5.7; 42 -2.4,5.7; 43 -3.2,5.7; 44 -4,5.7
G3VM-61GR2 = smd 0.8 x 1.2: P$1 -1.27,-3.1; P$2 1.27,-3.1; P$3 1.27,3.1; P$4 -1.27,3.1
MAX31855_SO-8 = smd 1.98 x 0.53: 1 -2.465,1.905; 2 -2.465,0.635; 3 -2.465,-0.635; 4 -2.465,-1.905; 5 2.465,-1.905; 6 2.465,-0.635; 7 2.465,0.635; 8 2.465,1.905
LM22678_TO-263-EP-7 = smd 0.91 x 2.41: P$1 -3.81,-12.4; P$2 -2.54,-12.4; P$3 -1.27,-12.4; P$4 0,-12.4; P$5 1.27,-12.4; P$6 2.54,-12.4; P$7 3.81,-12.4 | smd 5.59 x 6.35: PAD 0,-3.175
ADP3338_SOT-223-3 = smd 1.1 x 2: 1 -2.3,-2.54; 2 0,-2.54; 3 2.3,-2.54 | smd 3.3 x 2: PAD 0,3.36
SOIC-8_W = smd 2 x 0.5: 1 -3.185,1.905; 2 -3.185,0.635; 3 -3.185,-0.635; 4 -3.185,-1.905; 5 3.185,-1.905; 6 3.185,-0.635; 7 3.185,0.635; 8 3.185,1.905
CD74HC595_SOIC-16 = smd 2 x 0.5: 1 -3.1,4.445; 2 -3.1,3.175; 3 -3.1,1.905; 4 -3.1,0.635; 5 -3.1,-0.635; 6 -3.1,-1.905; 7 -3.1,-3.175; 8 -3.1,-4.445; 9 3.1,-4.445; 10 3.1,-3.175; 11 3.1,-1.905; 12 3.1,-0.635; 13 3.1,0.635; 14 3.1,1.905; 15 3.1,3.175; 16 3.1,4.445
CD74HC165_SOIC-16 = smd 2 x 0.5: 1 -3.1,4.445; 2 -3.1,3.175; 3 -3.1,1.905; 4 -3.1,0.635; 5 -3.1,-0.635; 6 -3.1,-1.905; 7 -3.1,-3.175; 8 -3.1,-4.445; 9 3.1,-4.445; 10 3.1,-3.175; 11 3.1,-1.905; 12 3.1,-0.635; 13 3.1,0.635; 14 3.1,1.905; 15 3.1,3.175; 16 3.1,4.445
FXOS8700CQR1 = smd 0.8 x 0.3: P$1 -1.275,1; P$2 -1.275,0.5; P$3 -1.275,0; P$4 -1.275,-0.5; P$5 -1.275,-1; P$9 1.275,-1; P$10 1.275,-0.5; P$11 1.275,0; P$12 1.275,0.5; P$13 1.275,1 | smd 0.3 x 0.8: P$6 -0.5,-1.275; P$7 0,-1.275; P$8 0.5,-1.275; P$14 0.5,1.275; P$15 0,1.275; P$16 -0.5,1.275
ACPL-C87_SSO-8 = smd 0.64 x 1.905: P$1 -1.905,-5.372; P$2 -0.635,-5.372; P$3 0.635,-5.372; P$4 1.905,-5.372; P$5 1.905,5.372; P$6 0.635,5.372; P$7 -0.635,5.372; P$8 -1.905,5.372
MAX11613_UMAX-8 = smd 1.35 x 0.4: P$1 -2.15,0.975; P$2 -2.15,0.325; P$3 -2.15,-0.325; P$4 -2.15,-0.975; P$5 2.15,-0.975; P$6 2.15,-0.325; P$7 2.15,0.325; P$8 2.15,0.975
SOT-23-5 = smd 1.05 x 0.6: P$1 -1.35,0.95; P$2 -1.35,0; P$3 -1.35,-0.95; P$4 1.35,-0.95; P$5 1.35,0.95
MOUNT_HOLE_150MIL = hole 3.81: 0,0
7MMX5MM = smd 2.2 x 1.4: P$1 -3.15,-1.27; P$2 -3.15,1.27; P$3 3.15,1.27 | smd 2.4 x 1.4: P$4 3.05,-1.27

### Placement (x,y rotation side)
3.3V_PWR  29.21,39.37 180 top
BOARD_PWR  149.35,13.97 90 top
C1  85.77,44.51 270 top
C2  93.34,34.92 270 top
C3  85.34,25.4 180 top
C4  75.95,34.16 90 top
C5  85.34,21.34 0 top
C6  13.21,60.45 180 top
C7  99.06,31.5 90 top
C8  82.55,44.45 90 top
C9  126.36,25.53 180 top
C10  25.41,22.35 90 top
C11  41.15,53.09 90 top
C12  37.59,58.29 0 top
C13  29.21,4.06 90 top
C14  42.06,16.3 270 top
C15  51.49,7.5 180 top
C16  9.74,40.37 0 top
C17  9.99,37.79 0 top
C18  121.59,9.92 180 top
C19  109.27,9.91 180 top
C20  76.2,9.91 180 top
C21  88.33,9.92 180 top
C22  23.44,45.16 0 top
C23  23.44,41.39 0 top
C24  13.9,53.36 270 top
C25  134.37,35.81 90 top
C26  131.7,33.02 180 top
C27  29.9,11.99 180 top
C28  41.76,7.63 180 top
C29  39.58,22.35 90 top
C30  43.08,22.35 90 top
C31  52.58,44.45 180 top
C32  64.77,53.09 90 top
C33  61.21,58.17 0 top
C34  56.9,53.09 90 top
C35  53.34,58.29 0 top
C36  138.43,36.83 0 top
C37  138.43,35.05 0 top
C38  49.02,53.09 90 top
C39  45.47,58.29 0 top
C40  137.41,28.7 270 top
C41  137.67,20.83 0 top
C42  143,24.38 180 top
C43  144.91,33.02 180 top
C44  149.35,23.37 0 top
C45  149.35,32 0 top
D2  129.21,3.88 90 top
D3  17.09,27.43 180 top
D7  45.47,61.72 0 top
D8  61.21,61.72 0 top
D9  53.34,61.72 0 top
D10  37.59,61.72 0 top
DISP1  21.59,66.8 270 top
FID1  7.62,60.2 0 top
FID2  149.1,21.34 0 top
J1  61.21,67.56 0 top
J2  53.34,67.56 0 top
J3  45.47,67.56 0 top
J4  37.59,67.56 0 top
J5  149.35,52.83 90 top
L2  99.47,9.82 180 top
L3  20.1,8.39 90 top
PROP_TC  60.45,31.5 90 top
PROP_UART  66.55,31.5 90 top
R1  85.34,23.37 180 top
R2  39.37,15.24 180 top
R3  29.72,60.45 90 top
R4  31.5,60.45 90 top
R5  26.16,60.45 90 top
R6  27.94,60.45 90 top
R7  17.02,60.45 90 top
R8  22.35,60.45 90 top
R9  85.34,57.4 180 top
R10  76.96,57.4 180 top
R11  25.4,39.37 180 top
R12  132.84,28.7 270 top
R13  134.87,28.7 270 top
R14  20.57,60.45 90 top
R15  51.82,36.32 270 top
R16  53.85,36.32 270 top
R17  68.83,57.4 180 top
R18  18.8,60.45 90 top
R19  108.33,25.27 270 top
R20  109.6,37.72 90 top
R21  108.33,40.77 90 top
R22  107.06,37.72 90 top
R23  105.79,40.77 90 top
R24  104.52,37.72 90 top
R25  103.25,40.77 90 top
R26  101.98,37.72 90 top
R27  139.45,61.21 90 top
R28  138.43,41.02 270 top
R29  135.89,41.02 270 top
R30  134.11,41.02 270 top
R31  130.68,41.02 270 top
R32  129.03,41.02 270 top
R33  125.73,41.02 270 top
R34  124.08,41.01 270 top
R35  120.58,41.01 270 top
R36  136.91,61.21 90 top
R37  134.37,61.21 90 top
R38  131.83,61.21 90 top
R39  129.29,61.21 90 top
R40  126.75,61.21 90 top
R41  124.21,61.21 90 top
R42  121.67,61.21 90 top
R43  143,22.61 180 top
R44  144.53,53.09 180 top
R45  144.53,51.56 180 top
RELAYS  102.87,67.56 180 top
SW1  68.83,60.2 0 top
SW2  76.96,60.2 0 top
SW3  85.34,60.2 0 top
SW_D  85.34,67.56 0 top
SW_S  76.96,67.56 0 top
SW_U  68.83,67.56 0 top
SWITCHS  130.05,67.56 180 top
TP1  34.04,3.05 90 top
TP2  20.32,51.56 0 top
TP3  81.79,2.86 180 top
TP4  115.18,2.86 180 top
TP5  67.44,13.67 180 top
TP6  115.57,17.74 180 top
TVS1  137.32,13.49 270 top
U1  84.58,34.54 90 top
U2  113.54,49.28 0 top
U3  111,58.17 0 top
U4  37.59,53.09 270 top
U5  32.43,27.19 0 top
U6  11.37,45.55 270 top
U7  52.58,40.64 0 top
U8  108.46,49.28 0 top
U9  61.21,53.09 270 top
U10  53.34,53.09 270 top
U11  45.47,53.09 270 top
U12  105.92,58.17 0 top
U13  103.38,49.28 0 top
U14  105.16,31.5 270 top
U15  100.84,58.17 0 top
U16  122.56,30.99 270 top
U17  98.3,49.28 0 top
U18  95.76,58.17 0 top
U19  138.18,55.12 180 top
U20  135.64,47.12 180 top
U21  133.1,55.12 180 top
U22  130.56,47.12 180 top
U23  128.02,55.12 180 top
U24  125.48,47.12 180 top
U25  122.94,55.12 180 top
U26  120.4,47.12 180 top
U27  135.89,32.51 0 top
U28  145.54,41.66 180 top
U29  137.67,23.62 180 top
U30  149.35,27.94 90 top
U$1  46.48,15.24 0 top
U$31  [MOUNT_HOLE_150MIL]  4.83,4.83 0 top
U$32  [MOUNT_HOLE_150MIL]  4.83,66.55 0 top
U$33  [MOUNT_HOLE_150MIL]  148.08,66.29 0 top
U$34  [MOUNT_HOLE_150MIL]  148.08,4.83 0 top
U$35  23.62,28.45 0 top
U$42  63.75,15.24 0 top
X1  84.2,49.07 0 top

### Tracks (layer width: path | path; a pad name or v marks a point on that pad's centre or on a via)
3.3V  (via drill 0.5)
  Top 0.254: U1.30 82.98,43.12 C8.1 81.42,43.55 v81.28,43.69 | U1.18 92.86,35.34 C2.1 94.35,35.83 v94.61,35.56 | U1.8 86.18,25.46 87.06,25.46 v87.38,25.15 | U1.40 76.43,33.74 C4.1 74.94,33.26 v74.68,33.53 | U7.8 53.98,42.55 53.48,43.04 C31.1 53.48,45.58 v53.34,45.72 | C9.1 127,25.79 U16.16 v127,29.72 | R11.2 22.61,39.37 | U27.P$14 136.39,34.54 136.91,35.05 C37.1 C36.1 v136.4,36.83 | U27.P$1 133.87,33.51 133.1,34.29 v133.1,34.92 133.49,34.91 C25.1 | U4.4 35.69,53.72 37.22,52.19 C11.1 42.28,52.19 v42.42,52.32 | U11.4 43.56,53.72 45.1,52.19 C38.1 50.15,52.19 v50.29,52.32 | U10.4 51.44,53.72 52.97,52.19 C34.1 | 56.78,52.07 C34.1 | C34.1 58.03,52.19 v58.17,52.32 | U9.4 59.31,53.72 60.84,52.19 C32.1 65.9,52.19 v66.04,52.32 | R17.1 71.12,57.4 v71.37,57.15 | R10.1 79.25,57.4 v79.5,57.15 | R9.1 87.63,57.4 v87.88,57.15 | R35.P$2 119.76,40.26 v119.38,39.88 | 135.78,40.27 R29.P$2 135.89,39.43 135.57,39.12 v135,39.12 134.54,39.12 134.23,39.43 134.23,40.27 R30.P$2 | R33.P$2 125.73,39.43 125.41,39.12 v124.84,39.12 124.4,39.12 124.08,39.43 R34.P$2 | R32.P$2 129.03,39.43 129.35,39.12 v129.92,39.12 130.37,39.12 130.68,39.43 R31.P$2 | R28.P$2 138.43,39.43 138.11,39.12 v137.67,39.12 | U14.10 101.98,30.6 | 109.6,30.6 110.1,30.6 v111.25,31.75 | 109.6,30.6 101.98,30.6 | 101.98,30.6 C7.1 | U14.16 109.6,30.6 | C1.1 86.8,45.41 v87.12,45.09 | R15.2 51.82,34.8 v52.83,33.78 53.85,34.8 R16.2 | R1.2 v83.31,23.37 | R12.2 v132.84,26.42 | v134.87,26.42 R13.2 | C41.1 136.82,22.19 136.36,22.65 U29.P$8 133.39,22.65 v133.35,22.61 | U28.P$8 147.45,34.67 147.07,34.29 146.05,34.29 145.76,34 C43.1 145.76,31.54 v145.8,31.5
  Top 0.305: 86.18,25.46 arc90 C3.1
  Bottom 0.254: v42.42,52.32 41.91,52.32 41.15,53.09 41.15,57.15 | v50.29,52.32 49.02,53.59 49.02,57.15 | v58.17,52.32 56.9,53.59 56.9,57.15 | v66.04,52.32 64.77,53.59 64.77,57.15 | v71.37,57.15 72.14,57.15 | v79.5,57.15 80.01,57.15 80.26,56.9 | v87.88,57.15 87.38,57.15 | v119.38,39.88 118.87,39.88 | v124.84,39.12 124.97,39.12 125.22,39.37 | 127,39.37 v127,29.72 129.03,29.72 131.7,27.05 | v111.25,31.75 111.25,39.37 | 97.03,40.89 94.61,38.48 v94.61,35.56 95.76,34.42 95.76,28.96 91.95,25.15 v87.38,25.15 85.6,23.37 v83.31,23.37 | v87.12,45.09 93.09,45.09 93.22,44.96 | 74.93,43.69 74.93,57.15 | v53.34,45.72 53.98,45.09 | 53.98,45.09 55.37,43.69 73.15,43.69 | 73.15,43.69 74.93,43.69 | v81.28,43.69 74.93,43.69 | v52.83,33.78 52.83,43.69 53.98,44.83 53.98,45.09 | v74.68,33.53 73.15,35.05 73.15,43.69 | v136.4,36.83 136.4,39.12 | v133.1,34.92 133.1,39.62 | v134.87,26.42 v132.84,26.42 132.33,26.42 131.7,27.05 | v133.35,22.61 132.59,22.61 130.3,24.89 130.3,25.65 131.7,27.05 | v145.8,31.5 145.8,30.99 145.03,30.23 143,30.23 141.73,31.5 141.73,38.35 140.72,39.37 138.49,39.37 138.43,39.43
  pour Top (isolate 0.305, no thermals): 7.87,44.96 10.67,44.96 18.29,37.34 23.37,37.34 23.37,50.29 18.29,55.37 15.24,55.37 13.97,54.1 13.97,49.41 10.79,46.23 7.87,46.23
  pour Bottom (no thermals): 24.13,56.64 25.51,57.91 90.42,57.66 93.47,54.61 93.47,45.21 98.3,40.39 139.7,40.64 139.7,38.35 98.55,38.61 92.46,44.7 92.46,54.1 89.92,56.64
  pour Bottom (isolate 0.305, no thermals): 25.4,57.91 19.54,52.05 arc45 19.3,51.48 arc90 20.24,50.55 arc45 20.81,50.78 26.67,56.64 26.67,57.91
5V_PWR
  Top 0.813: U6.3 C16.1 | C16.1 | C16.1 8.83,38.03 C17.1 4.88,37.79 4.83,37.85 | C6.1 14.61,62.61 13.97,63.25 11.18,63.25 10.41,64.01 10.41,69.09 11.43,70.1 14.73,70.1 15.24,69.6 DISP1.P$13
  pour Top (isolate 0.305, no thermals): 34.54,16 34.54,5.84 32.51,3.81 22.61,3.81 22.1,4.32 18.29,4.32 18.29,1.02 53.34,1.02 53.34,6.6 36.32,6.6 35.43,7.49 35.43,16
  pour Top (isolate 0.305, no thermals): 21.84,4.32 16.92,4.32 6.35,14.89 6.35,55.88 3.05,55.88 3.05,13.78 15.81,1.02 21.84,1.02
  pour Top (isolate 0.305, no thermals): 3.05,55.88 5.33,58.17 12.95,58.17 13.72,58.93 13.72,61.72 15.49,61.72 15.49,58.93 15.49,58.67 13.46,56.64 7.11,56.64 6.35,55.88
12V_BATT
  pour Top (isolate 0.305, rank 2, no thermals): 150.62,13.72 134.62,13.72 133.1,12.19 133.1,9.4 134.11,8.38 136.65,8.38 137.41,7.62 137.41,1.02 137.92,0.51 140.97,0.51 141.48,1.02 141.48,6.35 146.3,11.18 150.62,11.18 150.88,11.43 150.88,13.46
12V_BATT_ON  (via drill 0.5)
  Top 0.254: v147.57,20.83 147.95,21.21 C44.1 148.4,24.07 U30.P$1
  Bottom 0.254: v147.57,20.83 147.57,11.68 142.24,6.35 142.24,1.78 141.22,0.76 117.27,0.76 TP4.P$1
  pour Top (isolate 0.305, no thermals): 135.64,0.51 136.14,1.02 136.14,6.86 135.64,7.37 126.24,7.37 124.71,8.89 101.35,8.89 100.33,7.87 100.33,1.52 101.35,0.51
12V_CLEAN
  Top 0.254: R2.1 40.27,17.64 40.13,17.78
  pour Top (isolate 0.305, rank 2, no thermals): 23.88,21.59 23.88,17.78 25.15,16.51 29.46,16.51 29.46,13.72 30.23,13.72 30.23,16.51 44.7,16.51 44.7,21.84 38.1,21.84 34.8,18.54 27.43,18.54 26.67,19.3 26.67,21.59
  pour Top (isolate 0.305, no thermals): 98.55,7.87 98.55,1.48 97.07,0 72.73,0 71.12,1.61 71.12,7.87 72.14,8.89 97.54,8.89
  pour Top (isolate 0.305, no thermals): 43.94,21.84 53.09,21.84 66.04,8.89 73.15,8.89 73.15,0.51 68.83,0.51 52.83,16.51 43.94,16.51
165_CLK
  Top 0.254: U1.14 92.06,32.14 92.46,31.75 94.93,31.75 96.01,30.67 96.01,26.67 98.81,23.88 111.25,23.88 118.62,31.24 124.21,31.24 125.73,32.77 U16.2
165_DATA
  Top 0.254: U1.12 94.68,30.54 95,30.23 95,26.16 98.3,22.86 111.76,22.86 115.32,26.42 117.86,26.42 118.11,26.67 U16.9
165_LOAD
  Top 0.254: U1.13 92.1,31.34 92.2,31.24 94.79,31.24 95.5,30.52 95.5,26.42 98.55,23.37 111.51,23.37 118.87,30.73 125.22,30.73 127,32.51 U16.1
595_CLK
  Top 0.254: U14.11 103.25,26.8 102.62,26.16 99.31,26.16 97.54,27.94 97.54,34.08 94.92,36.69 92.57,36.69 92.02,36.14 U1.19
595_DATA
  Top 0.254: U14.14 107.06,26.29 105.92,25.15 98.81,25.15 96.52,27.43 96.52,30.78 95.04,32.26 92.71,32.26 92.02,32.94 U1.15
595_LAT
  Top 0.254: U14.12 104.52,26.8 103.38,25.65 99.06,25.65 97.03,27.69 97.03,30.97 95.23,32.77 92.96,32.77 91.99,33.74 U1.16
!RES!_PROP  (via drill 0.5)
  Top 0.254: PROP_TC.P$6 58.67,32.77 58.17,33.27 58.17,36.32 59.69,37.85 PROP_UART.6 | v83.31,21.34 C5.1
  Bottom 0.254: PROP_UART.6 83.06,21.34 v83.31,21.34
A0
  Top 0.254: U29.P$1 142.21,22.65 R43.P$2
CHASSIS_GND  (via drill 0.5)
  Top 0.254: v151.38,20.83 150.75,21.46 C44.2 150.3,23.82 U30.P$3 U30.P$4 150.3,31.68 150.62,32 | 150.62,32 150.3,32 150.3,33.72 v151.38,34.8 | 150.62,32 C45.2 | R44.P$1 145.28,56.12 v145.29,56.13 | U28.P$4 143.64,48.64 | 143.64,48.64 142.75,49.53 v142.75,56.13 | U28.P$3 144.91,48.24 144.5,48.64 143.64,48.64
  Top 0.305: U18.P$3 v97.03,59.69 | U19.P$2 v136.91,56.9 | U21.P$2 v131.83,56.9 | U23.P$2 v126.75,56.9 | U25.P$2 v121.67,56.9 | U3.P$3 v112.27,59.69 | U12.P$3 v107.19,59.69 | U15.P$3 v102.11,59.69 | U17.P$3 v99.57,50.8 | U20.P$2 v134.37,48.26 | U22.P$2 v129.29,48.26 | U24.P$2 v124.21,48.26 | U26.P$2 v119.13,48.26 | U2.P$3 v114.81,50.8 | U8.P$3 v109.73,50.8 | U13.P$3 v104.65,50.8
  Bottom 0.254: v151.38,20.83 151.38,20.32 | v145.29,56.13 145.54,56.13 145.8,56.39 | v151.38,34.8 151.38,35.31 | v142.75,56.13 143.76,56.13
  Bottom 0.61: v97.03,59.69 v102.11,59.69 v107.19,59.69 v112.27,59.69 115.57,59.69 118.36,56.9 v121.67,56.9 v126.75,56.9 v131.83,56.9 v136.91,56.9 140.36,56.9 140.72,56.54 140.72,52.58 136.4,48.26 v134.37,48.26 v129.29,48.26 v124.21,48.26 v119.13,48.26 118.36,48.26 115.82,50.8 v114.81,50.8 v109.73,50.8 v104.65,50.8 v99.57,50.8
  pour Top (isolate 0.305, no thermals): 150.88,14.48 150.62,14.22 142.49,14.22 126.75,14.22 123.44,10.92 101.35,10.92 100.33,11.94 100.33,18.29 101.6,19.56 150.62,19.56 150.88,19.3
  pour Bottom (no thermals): 140.59,55.63 140.59,57.02 150.5,57.02 152.15,55.37 152.15,14.99 151.38,14.22 148.84,14.22 148.34,14.73 148.34,15.75 148.84,16.26 150.37,16.26 150.88,16.76 150.88,54.61 149.86,55.63
D4
  Top 0.254: R6.2 27.94,62.74 29.21,64.01 29.21,66.8 DISP1.P$3
D5
  Top 0.254: R5.2 26.16,63.75 DISP1.P$4
D6
  Top 0.254: R4.2 31.5,62.48 33.02,64.01 33.02,66.8 31.75,68.07 DISP1.P$1
D7
  Top 0.254: R3.2 29.72,62.48 30.48,63.25 DISP1.P$2
E1
  Top 0.254: R8.2 22.35,63.5 DISP1.P$10
E2
  Top 0.254: R7.2 17.02,63.5 16.26,64.26 13.97,64.26 DISP1.P$16
EXT_5V
  Top 0.254: U30.P$5 148.4,31.55 C45.1 147.95,33.91 149.1,35.05 149.1,37.59 147.45,39.24 U28.P$1
GND  (via drill 0.5)
  Top 0.254: U1.27 85.38,43.22 arc-90 C1.2 86.79,43.61 v87.12,43.94 | U1.17 92.83,34.54 C2.2 94.35,34.02 v94.61,34.29 | U1.6 84.58,26.92 | 84.58,26.92 84.58,25.54 C3.2 83.82,25.4 v83.31,24.89 | U1.5 83.78,27.31 84.17,26.92 84.58,26.92 | U1.39 76.47,34.54 C4.2 74.94,35.06 v74.68,34.8 | U7.7 52.96,41.27 51.68,42.56 C31.2 51.68,45.58 v51.82,45.72 | U7.3 47.12,40.01 v46.99,40.13 | U7.2 47.12,41.27 v46.99,41.4 | U7.4 47.12,38.73 v46.99,38.86 | PROP_TC.P$5 61.21,32.77 61.72,32.26 62.23,32.26 64.26,34.29 v64.26,35.31 | C8.2 81.42,45.35 v81.28,45.21 | X1.P$2 79.43,50.34 v79.38,50.29 | X1.P$4 88.85,47.8 v89.03,47.75 | C7.2 v99.06,33.53 99.31,33.27 100.58,33.27 100.71,33.4 U14.8 | U14.13 105.79,26.54 v105.41,26.16 | C9.2 125.73,25.79 U16.15 v125.73,29.72 | U16.8 v118.11,36.07 | U25.P$3 v121.67,53.59 | U23.P$3 v126.75,53.59 | U21.P$3 v131.83,53.59 | U19.P$3 v136.91,53.59 | U26.P$3 v119.13,45.72 | U24.P$3 v124.21,45.72 | U22.P$3 v129.29,45.72 | U20.P$3 v134.37,45.72 | U17.P$2 v99.57,47.75 | U13.P$2 v104.65,47.75 | U8.P$2 v109.73,47.75 | U2.P$2 v114.81,47.75 | U3.P$2 v112.27,56.64 | U12.P$2 v107.19,56.64 | U15.P$2 v102.11,56.64 | U18.P$2 v97.03,56.64 | SW3.P$4 88.84,59.12 v88.9,59.18 | SW2.P$4 80.46,59.12 v80.52,59.18 | SW1.P$4 72.33,59.12 v72.39,59.18 | v66.04,53.85 65.9,53.99 C32.2 63.44,53.99 63.12,54.3 U9.1 | v58.17,53.85 58.03,53.99 C34.2 55.56,53.99 55.24,54.3 U10.1 | v50.29,53.85 50.15,53.99 C38.2 47.69,53.99 47.37,54.3 U11.1 | v42.42,53.72 42.15,53.99 C11.2 39.81,53.99 39.5,54.3 U4.1 | D8.3 v61.21,64.26 | D9.3 v53.34,64.26 | D7.3 v45.47,64.26 | D10.3 v37.59,64.26 | 3.3V_PWR.CATHODE v31.5,39.37 | U27.P$7 135.89,30.23 v136.14,29.97
  Top 0.254: C40.2 v137.41,26.67 | v131.32,34.29 130.8,33.77 C26.2 130.8,32.14 130.94,32 133.1,32 133.6,32.51 U27.P$3 | U27.P$5 134.13,31.51 133.86,31.24 v133.86,30.73 | U27.P$13 139.33,33.51 | U27.P$12 139.33,33.01 | 139.33,33.01 139.33,33.51 | 139.33,33.51 C37.2 C36.2 v140.46,36.83 | U27.P$10 138.64,32.01 139.33,32.7 139.33,33.01 | U27.P$16 135.39,36.07 | 135.39,36.07 135.39,36.31 134.99,36.71 C25.2 | v135.64,36.07 135.39,36.07 | U29.P$7 136.72,23.3 138.52,21.5 C41.2 139.7,20.83 v139.95,20.57 | C42.2 142.24,24.47 v142.24,25.65 | U28.P$6 144.91,34.92 144.02,34.04 | 144.02,33.06 144.02,31.75 v143.76,31.5 | 144.02,34.04 144.02,33.06 | 144.02,33.06 C43.2 | U28.P$5 143.64,34.42 144.02,34.04
  Top 0.61: C24.NEG 11.28,53.34 v9.14,53.34 | U6.1 10.67,47.85 v10.67,47.88 | C17.2 13.46,37.79 v13.46,37.85 | C16.2 11.94,40.37 v11.94,40.39 | C22.2 26.67,45.16 v26.67,45.21 | C23.2 v25.65,41.39 v25.65,41.4
  Top 0.813: C6.2 v9.91,60.45
  Bottom 0.254: v46.99,40.13 46.99,40.39 | v46.99,41.4 46.99,40.89 | v46.99,38.86 46.99,39.12 47.24,39.37 | v51.82,45.72 51.82,45.97 | v64.26,35.31 64.26,35.81 | v94.61,34.29 94.74,34.54 | v81.28,45.21 81.03,45.21 | v87.12,43.94 87.12,44.2 | 87.88,46.23 88.65,46.23 | v79.38,50.29 78.99,49.28 | v89.03,47.75 89.15,47.5 | v99.06,33.53 99.06,34.04 | v105.41,26.16 104.9,26.16 | v125.73,29.72 125.48,29.72 | v118.11,36.07 118.11,36.32 | v119.13,45.72 119.13,45.47 | v124.21,45.72 124.21,45.21 | v129.29,45.72 129.03,45.72 | v134.37,45.72 134.11,45.72 | v121.67,53.59 121.92,53.59 | v126.75,53.59 127,53.59 | v131.83,53.59 132.33,53.59 | v136.91,53.59 136.4,53.59 | v99.57,47.75 99.31,47.75 | v104.65,47.75 104.14,47.75 | v109.73,47.75 109.47,47.75 | v114.81,47.75 114.3,47.75 | v112.27,56.64 112.01,56.64 | v107.19,56.64 106.93,56.64 | v102.11,56.64 101.6,56.64 | v97.03,56.64 96.52,56.64 | v88.9,59.18 88.9,59.44 | v80.52,59.18 80.52,59.44 | v72.39,59.18 72.39,59.44 | v66.04,53.85 66.04,53.59 | v58.17,53.85 58.17,53.59 | v50.29,53.85 50.04,53.59 | v42.42,53.72 42.55,53.59 | v61.21,64.26 61.21,64.77 | v53.34,64.26 53.34,64.52 | v45.47,64.26 45.47,64.52 | v37.59,64.26 37.59,64.52 | v31.5,39.37 31.5,39.88 | v136.14,29.97 136.14,29.72 | v137.41,26.67 137.67,26.92 | v131.32,34.29 131.57,34.54 | v133.86,30.73 133.6,30.73 | v140.46,36.83 140.72,36.58 | v142.24,25.65 141.99,25.91 141.73,25.91 | v143.76,31.5 143.51,31.5
  Bottom 0.61: v9.14,53.34 9.14,53.85 | v13.46,37.85 13.46,38.35 | v11.94,40.39 11.94,40.64 | v26.67,45.21 26.67,45.47 | v25.65,41.4 25.65,41.66
  Bottom 0.813: v9.91,60.45 9.91,59.94
  other vias: 7.62,15.49 7.62,16.76 7.62,18.03 7.62,19.3 7.62,20.57 7.62,21.84 7.62,23.11 7.62,24.38 7.62,25.65 7.62,26.92 7.62,28.19 7.62,29.46 7.62,30.73 7.62,32 7.62,33.27 7.62,34.54 23.37,10.92 22.1,10.92 20.83,10.92 19.56,10.92 18.29,10.92 17.02,10.92 16.51,31.37 16.51,32.64 16.51,33.91 12.57,31.37 12.57,32.64 12.57,33.91 24.64,25.78 26.16,25.78 30.48,28.19 31.75,28.19 33.02,28.19 34.29,28.19 28.7,22.1 28.7,23.37 28.7,24.64 28.7,25.91 30.48,19.81 31.75,19.81 33.02,19.81 34.29,19.81 36.07,22.1 36.07,23.37 36.07,24.64 36.07,25.91 42.42,25.78 43.94,25.78 38.86,25.78 40.39,25.78 28.45,7.24 29.97,7.24 40.26,9.78 40.26,11.05 40.26,12.32 40.26,13.59 43.31,9.78 43.31,11.05 43.31,12.32 43.31,13.59 49.91,9.53 49.91,10.79 49.91,12.06 49.91,13.34 52.96,9.53 52.96,10.79 52.96,12.06 52.96,13.34 32.38,12.57 32.38,11.56 32.38,10.54 74.68,11.81 74.68,13.08 74.68,14.35 74.68,15.62 77.72,11.81 77.72,13.08 77.72,14.35 77.72,15.62
  pour Bottom (isolate 0.406, rank 6): 0,5.08 0,66.04 arc-90 5.08,71.12 147.83,71.12 arc-90 152.91,66.04 152.91,5.08 arc-90 147.83,0 5.08,0 arc-90
  pour Top (isolate 0.305, rank 6, no thermals): 3.56,35.31 36.12,35.31 57.66,13.76 57.66,1.02 3.56,1.02
  pour Top (isolate 0.305, no thermals): 98.55,11.94 97.54,10.92 67.06,10.92 66.04,11.94 66.04,16.76 67.06,17.78 97.54,17.78 98.55,16.76
IN_OPTO_1
  Top 0.254: U16.12 121.92,25.91 124.71,23.11 128.27,23.11 129.54,24.38 129.54,34.8 133.1,38.35 135.89,38.35 136.91,39.37 136.91,41.77 | 136.91,41.77 U20.P$4 | R29.P$1 136.91,41.77
IN_OPTO_2
  Top 0.254: U16.13 123.19,25.4 124.97,23.62 128.02,23.62 129.03,24.64 129.03,35.31 133.1,39.37 133.1,41.77 | 133.1,41.77 133.1,51.31 133.81,52.02 U21.P$4 | R30.P$1 133.1,41.77
IN_OPTO_3
  Top 0.254: 131.83,41.77 131.83,38.86 128.52,35.56 128.52,24.89 127.76,24.13 125.22,24.13 124.46,24.89 U16.14 | 131.83,41.77 U22.P$4 | R31.P$1 131.83,41.77
IN_OPTO_4
  Top 0.254: U16.3 124.46,36.32 125.48,37.34 126.75,37.34 128.02,38.61 128.02,41.77 | 128.02,41.77 128.02,51.56 128.47,52.02 U23.P$4 | R32.P$1 128.02,41.77
IN_OPTO_5
  Top 0.254: U16.4 123.19,36.83 124.71,38.35 126.24,38.35 126.75,38.86 126.75,41.77 | 126.75,41.77 U24.P$4 | R33.P$1 126.75,41.77
IN_OPTO_6
  Top 0.254: 122.94,41.76 122.94,39.62 121.92,38.61 U16.5 | 122.94,41.76 122.94,51.56 123.39,52.02 U25.P$4 | R34.P$1 122.94,41.76
IN_OPTO_7
  Top 0.254: 121.67,41.76 121.67,39.37 120.65,38.35 U16.6 | 121.67,41.76 U26.P$4 | R35.P$1 121.67,41.76
N$1
  Top 0.254: U16.11 120.65,25.91 123.95,22.61 128.52,22.61 130.05,24.13 130.05,34.54 133.35,37.85 137.92,37.85 139.45,39.37 139.45,41.77 | 139.45,41.77 U19.P$4 | R28.P$1 139.45,41.77
N$2
  Top 0.254: C27.1 30.8,12.76 31.16,13.13 U5.P$3
N$3
  Top 0.254: R27.P$1 U19.P$1
N$4
  Top 0.254: R36.P$1 136.91,59.94 135.64,58.67 135.64,50.8 136.22,50.22 U20.P$1
N$5
  Top 0.254: C27.2 29,12.66 28.62,13.04 U5.P$1
  pour Top (isolate 0.305, no thermals): 11.68,26.92 11.68,15.49 14.99,12.19 26.42,12.19 27.69,13.46 28.96,13.46 28.96,16 24.89,16 22.61,18.29 22.61,26.92
N$6
  Top 0.254: R37.P$1 U21.P$1
N$7
  Top 0.254: C26.1 U27.P$2
N$8
  Top 0.254: U27.P$8 136.39,30.74 136.65,30.48 137.16,30.48 137.41,30.23 C40.1
N$9
  Top 0.254: R11.1 3.3V_PWR.ANODE
N$10
  Top 0.254: R38.P$1 131.83,59.94 130.56,58.67 130.56,50.8 131.14,50.22 U22.P$1
N$11
  Top 0.254: R19.P$2 110.88,24.52 112.27,25.91 U2.P$1
N$12
  Top 0.254: R20.P$2 109.6,40.01 111,41.4 111,54.61 110.49,55.12 109.78,55.12 U3.P$1
N$13
  Top 0.254: R21.P$2 108.33,43.81 107.19,44.96 U8.P$1
N$14
  Top 0.254: R22.P$2 107.06,43.81 106.17,44.7 106.17,54.36 105.46,55.07 U12.P$1
N$15
  Top 0.254: R23.P$2 105.79,42.14 102.97,44.96 102.36,44.96 102.11,45.21 U13.P$1
N$16
  Top 0.254: R24.P$2 104.52,41.78 100.84,45.47 100.84,54.61 100.38,55.07 U15.P$1
N$17
  Top 0.254: R25.P$2 103.25,42.27 100.56,44.96 97.28,44.96 97.03,45.21 U17.P$1
N$18
  Top 0.254: R26.P$2 101.98,42.8 100.33,44.45 96.52,44.45 94.49,46.48 U18.P$1
N$19
  Top 0.254: R39.P$1 U23.P$1
N$20
  Top 0.254: R40.P$1 126.75,59.94 125.48,58.67 125.48,50.8 126.06,50.22 U24.P$1
N$21
  Top 0.254: R41.P$1 U25.P$1
N$22
  Top 0.254: R42.P$1 121.67,59.94 120.4,58.67 120.4,50.8 120.98,50.22 U26.P$1
N$23
  Top 0.254: R27.P$2 139.45,65.53 SWITCHS.P$1
N$24
  Top 0.254: R36.P$2 136.91,65.53 SWITCHS.P$2
N$25
  Top 0.254: R37.P$2 134.37,65.53 SWITCHS.P$3
N$26
  Top 0.254: R38.P$2 131.83,65.53 SWITCHS.P$4
N$27
  Top 0.254: R39.P$2 129.29,65.53 SWITCHS.P$5
N$28
  Top 0.254: R40.P$2 126.75,65.53 SWITCHS.P$6
N$29
  Top 0.254: R41.P$2 124.21,65.53 SWITCHS.P$7
N$30
  Top 0.254: R42.P$2 121.67,65.53 SWITCHS.P$8
N$31
  Top 0.254: U5.P$7 38.47,14.79 R2.2
N$32
  Top 0.254: R43.P$1 143.75,24.38 C42.1 144.78,24.38 144.91,24.51 144.91,33.91 146.18,35.18 U28.P$7
N$33
  Top 0.254: R44.P$2 R45.P$2 143.76,51.55 143.76,50.55 144.53,49.78 145.29,49.78 146.18,48.9 U28.P$2
N$36
  Top 0.254: J5.P$1 R45.P$1
OUT_0
  Top 0.254: U14.15 R19.P$1
OUT_1
  Top 0.254: U14.1 R20.P$1
OUT_2
  Top 0.254: U14.2 R21.P$1
OUT_3
  Top 0.254: U14.3 R22.P$1
OUT_4
  Top 0.254: U14.4 R23.P$1
OUT_5
  Top 0.254: U14.5 R24.P$1
OUT_6
  Top 0.254: U14.6 R25.P$1
OUT_7
  Top 0.254: U14.7 R26.P$1
PROP_D4
  Top 0.254: R6.1 27.94,54.61 59.94,22.61 72.39,22.61 75.95,26.16 75.95,29.21 77.28,30.54 U1.44
PROP_D5
  Top 0.254: R5.1 26.16,55.63 60.71,21.08 75.95,21.08 80.58,25.72 U1.1
PROP_D6
  Top 0.254: R4.1 31.5,52.58 60.45,23.62 71.88,23.62 74.93,26.67 74.93,29.72 77.36,32.14 U1.42
PROP_D7
  Top 0.254: R3.1 29.72,53.59 60.2,23.11 72.14,23.11 75.44,26.42 75.44,29.46 77.32,31.34 U1.43
PROP_E1
  Top 0.254: R8.1 22.35,58.67 60.45,20.57 76.2,20.57 81.38,25.76 U1.2
PROP_E2
  Top 0.254: R7.1 17.02,58.93 17.53,58.42 18.54,58.42 57.91,19.05 86.11,19.05 88.16,21.11 88.16,25.63 86.98,26.81 U1.9
PROP_R/W
  Top 0.254: R14.1 20.57,58.93 59.44,20.07 76.45,20.07 82.18,25.79 U1.3
PROP_RES
  Top 0.254: U1.7 85.38,23.58 85.6,23.37 R1.1 C5.2
PROP_RS
  Top 0.254: R18.1 18.8,58.93 58.17,19.56 76.71,19.56 82.04,24.89 82.98,25.83 U1.4
R/W
  Top 0.254: R14.2 20.57,62.74 19.05,64.26 19.05,66.8 DISP1.P$9
RLY_0
  Top 0.254: U2.P$4 113.34,52.38 113.54,52.58 113.54,66.8 RELAYS.P$1
RLY_1
  Top 0.254: U3.P$4 109.73,65.53 RELAYS.P$2
RLY_2
  Top 0.254: U8.P$4 108.26,52.38 108.46,52.58 108.46,66.8 RELAYS.P$3
RLY_3
  Top 0.254: U12.P$4 104.65,65.53 RELAYS.P$4
RLY_4
  Top 0.254: U13.P$4 102.92,52.38 103.38,52.83 103.38,66.8 RELAYS.P$5
RLY_5
  Top 0.254: U15.P$4 99.57,65.53 RELAYS.P$6
RLY_6
  Top 0.254: U17.P$4 97.84,52.38 98.3,52.83 98.3,66.8 RELAYS.P$7
RLY_7
  Top 0.254: U18.P$4 94.49,65.53 RELAYS.P$8
RS
  Top 0.254: R18.2 18.8,62.74 17.78,63.75 DISP1.P$12
RX_PROP
  Top 0.254: PROP_TC.P$4 58.67,31.5 58.17,30.99 58.17,28.19 58.93,27.43 61.21,27.43 PROP_UART.4 70.36,32.77 73.41,35.81 76.96,35.81 77.43,35.34 U1.38
SCL
  Top 0.254: U1.35 72.24,37.74 69.98,40.01 U7.6 52.96,40.01 51.82,38.86 R15.1
SCL_1  (via drill 0.5)
  Top 0.254: U27.P$4 133.87,32.01 132.84,30.99 R12.1 132.17,29.55 131.83,29.21 v131.83,25.15 131.83,23.62 129.29,21.08 94.23,21.08 88.58,26.73 U1.11 | U29.P$5 136.36,24.6 v136.91,25.15
  Bottom 0.254: v136.91,25.15 v131.83,25.15
SDA
  Top 0.254: U1.36 71.77,36.94 69.34,39.37 65.02,39.37 64.39,38.73 U7.5 54.23,38.73 53.85,38.35 R16.1
SDA_1
  Top 0.254: U27.P$6 135.39,30.74 134.87,30.23 R13.1 134.2,29.55 133.86,29.21 133.86,24.89 133.48,24.51 | U1.10 87.78,26.77 93.98,20.57 129.54,20.57 133.48,24.51 | U29.P$6 134.04,23.95 133.48,24.51
SW_D
  Top 0.254: SW_D.P$1 84.07,62.08 | 84.07,62.08 SW3.P$1 | 84.07,62.08 84.44,61.71 R9.2 84.44,55.26 84.84,54.86 89.66,54.86 91.95,52.58 91.95,38.86 91.63,38.54 U1.22
SW_S
  Top 0.254: SW_S.P$1 75.69,62.08 | 75.69,62.08 SW2.P$1 | 75.69,62.08 76.06,61.71 R10.2 76.06,55.26 76.96,54.36 89.41,54.36 91.44,52.32 91.44,44.96 88.58,42.1 U1.23
SW_U
  Top 0.254: SW_U.P$1 67.56,62.08 | 67.56,62.08 SW1.P$1 | 67.56,62.08 67.93,61.71 R17.2 67.93,56.02 70.1,53.85 89.15,53.85 90.93,52.07 90.93,45.21 87.78,42.06 U1.24
T+_0
  Top 0.254: U9.3 60.58,58.41 C33.1 60.26,58.22 D8.1 59.94,60.94 J1.P$1
T+_1
  Top 0.254: J2.P$1 52.07,60.94 D9.1 52.39,58.34 C35.1 52.7,58.03 U10.3
T+_2
  Top 0.254: J3.P$1 44.2,60.94 D7.1 44.57,60.57 C39.1 44.83,58.03 U11.3
T+_3
  Top 0.254: J4.P$1 36.32,60.94 D10.1 36.69,60.57 C12.1 36.96,58.29 U4.3
T-_0
  Top 0.254: U9.2 61.85,58.41 C33.2 62.16,58.22 D8.2 62.48,60.94 J1.P$2
T-_1
  Top 0.254: J2.P$2 54.61,60.94 D9.2 54.29,58.34 C35.2 53.98,58.03 U10.2
T-_2
  Top 0.254: J3.P$2 46.74,60.94 D7.2 46.37,60.57 C39.2 46.1,58.03 U11.2
T-_3
  Top 0.254: J4.P$2 38.86,60.94 D10.2 38.49,60.57 C12.2 38.23,58.29 U4.2
TC_CS_0
  Top 0.254: U1.25 86.98,42.02 90.42,45.47 90.42,51.82 88.9,53.34 78.99,53.34 73.91,48.26 61.21,48.26 60.58,48.9 U9.6
TC_CS_1
  Top 0.254: U1.26 86.18,41.99 89.92,45.72 89.92,51.56 88.65,52.83 79.25,52.83 74.17,47.75 60.2,47.75 59.94,47.5 58.93,47.5 58.67,47.75 53.59,47.75 53.21,48.13 52.7,48.64 U10.6
TC_CS_2
  Top 0.254: U1.31 82.18,41.52 76.45,47.24 60.45,47.24 60.2,46.99 58.67,46.99 58.42,47.24 46.35,47.24 44.83,48.77 U11.6
TC_CS_3
  Top 0.254: U1.32 81.38,41.55 76.2,46.74 60.71,46.74 60.45,46.48 58.42,46.48 58.17,46.74 38.86,46.74 36.96,48.64 U4.6
TC_SCK  (via drill 0.5)
  Top 0.254: v35.56,52.32 35.69,52.2 U4.5 | U11.5 43.56,48.39 v43.69,48.26 | U10.5 51.44,48.39 v51.56,48.26 | U9.5 59.31,48.39 v59.44,48.26 | U1.34 77.03,38.54 76.45,39.12 76.45,43.94 75.44,44.96 73.15,44.96 v72.14,45.97
  Bottom 0.254: v35.56,52.32 35.69,52.2 U4.5 38.05,48.26 v43.69,48.26 v51.56,48.26 v59.44,48.26 69.85,48.26 71.37,46.74 v72.14,45.97
TC_SO  (via drill 0.5)
  Top 0.254: v38.35,49.02 38.23,49.15 U4.7 | U11.7 46.1,49.15 v46.23,49.02 | U10.7 53.98,49.15 v54.1,49.02 | U9.7 61.85,49.15 v61.98,49.02 | U1.33 80.58,41.34 75.95,45.97 v73.15,45.97
  Bottom 0.254: v38.35,49.02 v46.23,49.02 v54.1,49.02 v61.98,49.02 70.1,49.02 v73.15,45.97
TX_PROP
  Top 0.254: PROP_TC.P$3 62.74,31.5 PROP_UART.5 72.14,35.31 73.15,36.32 77.22,36.32 77.39,36.14 U1.37
X0
  Top 0.254: U1.29 83.78,46.52 arc90 82.55,47.75 81.1,47.75
  Top 0.305: 81.1,47.75 arc-90 X1.P$1
X1
  Top 0.254: U1.28 84.58,48.9 arc-90 85.98,50.29 87.3,50.29
  Top 0.305: 87.3,50.29 arc90 X1.P$3